# EAGLE design brushless_module_v2 (EAGLE 6.6.0)

## Sheet 1 of 17
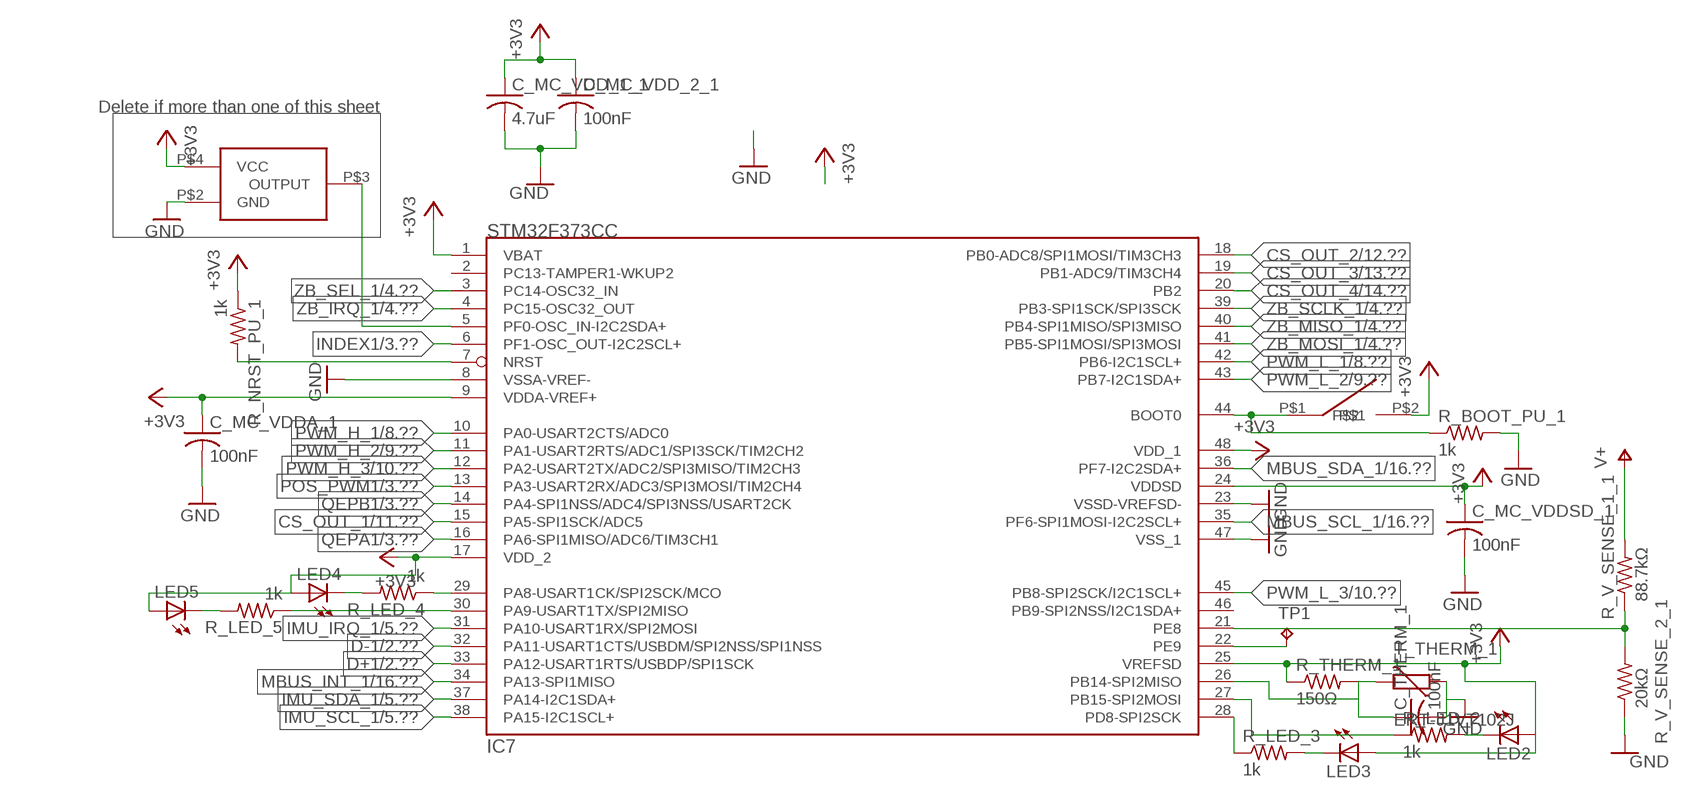
[diagram p0: schematic, sheet 1]

### Parts
C_MC_VDD_1_1  4.7uF  C-USC0603  [C0603]
C_MC_VDD_2_1  100nF  C-USC0603  [C0603]
C_MC_VDDA_1  100nF  C-USC0603  [C0603]
C_MC_VDDSD_1  100nF  C-USC0603  [C0603]
C_THERM_1  100nF  C-USC0603  [C0603]
IC7  STM32F373CC  [LQFP48]
LED2  LEDCHIPLED_0603  [CHIPLED_0603]
LED3  LEDCHIPLED_0603  [CHIPLED_0603]
LED4  LEDCHIPLED_0603  [CHIPLED_0603]
LED5  LEDCHIPLED_0603  [CHIPLED_0603]
OSC1  FOX924B  [4-SMD_5X3.2]
R_BOOT_PU_1  1k  R-US_R0603  [R0603]
R_LED_2  1k  R-US_R0603  [R0603]
R_LED_3  1k  R-US_R0603  [R0603]
R_LED_4  1k  R-US_R0603  [R0603]
R_LED_5  1k  R-US_R0603  [R0603]
R_NRST_PU_1  1k  R-US_R0603  [R0603]
R_THERM_1  150Ω  R-US_R0603  [R0603]
R_V_SENSE_1_1  88.7kΩ  R-US_R0603  [R0603]
R_V_SENSE_2_1  20kΩ  R-US_R0603  [R0603]
SW1  B3U  [B3U]
T_THERM_1  ERT-J1VT102J  VARISTORCN0603  [CT/CN0603]
TP1  TPTP10R  [TP10R]

### Nets
16MHZ_3V3: IC7.5(PF0-OSC_IN-I2C2SDA+) OSC1.P$3(OUTPUT) ; also sheet 4
+3V3: C_MC_VDD_1_1.1 C_MC_VDD_2_1.1 C_MC_VDDA_1.1 C_MC_VDDSD_1.1 IC7.1(VBAT) IC7.9(VDDA-VREF+) IC7.17(VDD_2) IC7.24(VDDSD) IC7.25(VREFSD) IC7.48(VDD_1) LED2.A LED3.A LED4.A LED5.A OSC1.P$4(VCC) R_NRST_PU_1.1 R_THERM_1.1 SW1.P$2 ; also sheet 3,4,5,6,7,14,16
BOOT0_1: IC7.44(BOOT0) R_BOOT_PU_1.1 SW1.P$1
CS_OUT_1: IC7.15(PA5-SPI1SCK/ADC5) ; also sheet 11
CS_OUT_2: IC7.18(PB0-ADC8/SPI1MOSI/TIM3CH3) ; also sheet 12
CS_OUT_3: IC7.19(PB1-ADC9/TIM3CH4) ; also sheet 13
CS_OUT_4: IC7.20(PB2) ; also sheet 14
D+1: IC7.33(PA12-USART1RTS/USBDP/SPI1SCK) ; also sheet 2
D-1: IC7.32(PA11-USART1CTS/USBDM/SPI2NSS/SPI1NSS) ; also sheet 2
GND: C_MC_VDD_1_1.2 C_MC_VDD_2_1.2 C_MC_VDDA_1.2 C_MC_VDDSD_1.2 C_THERM_1.2 IC7.8(VSSA-VREF-) IC7.23(VSSD-VREFSD-) IC7.47(VSS_1) OSC1.P$2(GND) R_BOOT_PU_1.2 R_V_SENSE_2_1.1 T_THERM_1.1 ; also sheet 2,3,4,5,6,7,8,9,10,11,12,13,14,15,16,17
IMU_IRQ_1: IC7.31(PA10-USART1RX/SPI2MOSI) ; also sheet 5
IMU_SCL_1: IC7.38(PA15-I2C1SCL+) ; also sheet 5
IMU_SDA_1: IC7.37(PA14-I2C1SDA+) ; also sheet 5
INDEX1: IC7.6(PF1-OSC_OUT-I2C2SCL+) ; also sheet 3
MBUS_INT_1: IC7.34(PA13-SPI1MISO) ; also sheet 16
MBUS_SCL_1: IC7.35(PF6-SPI1MOSI-I2C2SCL+) ; also sheet 16
MBUS_SDA_1: IC7.36(PF7-I2C2SDA+) ; also sheet 16
N$3: IC7.21(PE8) R_V_SENSE_1_1.1 R_V_SENSE_2_1.2
N$5: LED2.C R_LED_2.2
N$6: LED3.C R_LED_3.2
N$8: IC7.27(PB15-SPI2MOSI) R_LED_2.1
N$9: IC7.28(PD8-SPI2SCK) R_LED_3.1
N$10: LED4.C R_LED_4.2
N$11: LED5.C R_LED_5.2
N$12: IC7.29(PA8-USART1CK/SPI2SCK/MCO) R_LED_4.1
N$13: IC7.30(PA9-USART1TX/SPI2MISO) R_LED_5.1
N$18: IC7.22(PE9) TP1.TP
NRST_1: IC7.7(NRST) R_NRST_PU_1.2
POS_PWM1: IC7.13(PA3-USART2RX/ADC3/SPI3MOSI/TIM2CH4) ; also sheet 3
PWM_H_1: IC7.10(PA0-USART2CTS/ADC0) ; also sheet 8
PWM_H_2: IC7.11(PA1-USART2RTS/ADC1/SPI3SCK/TIM2CH2) ; also sheet 9
PWM_H_3: IC7.12(PA2-USART2TX/ADC2/SPI3MISO/TIM2CH3) ; also sheet 10
PWM_L_1: IC7.42(PB6-I2C1SCL+) ; also sheet 8
PWM_L_2: IC7.43(PB7-I2C1SDA+) ; also sheet 9
PWM_L_3: IC7.45(PB8-SPI2SCK/I2C1SCL+) ; also sheet 10
QEPA1: IC7.16(PA6-SPI1MISO/ADC6/TIM3CH1) ; also sheet 3
QEPB1: IC7.14(PA4-SPI1NSS/ADC4/SPI3NSS/USART2CK) ; also sheet 3
THERM: C_THERM_1.1 IC7.26(PB14-SPI2MISO) R_THERM_1.2 T_THERM_1.2
V+: R_V_SENSE_1_1.2 ; also sheet 6,7,8,9,10,11,12,13,14,15
ZB_IRQ_1: IC7.4(PC15-OSC32_OUT) ; also sheet 4
ZB_MISO_1: IC7.40(PB4-SPI1MISO/SPI3MISO) ; also sheet 4
ZB_MOSI_1: IC7.41(PB5-SPI1MOSI/SPI3MOSI) ; also sheet 4
ZB_SCLK_1: IC7.39(PB3-SPI1SCK/SPI3SCK) ; also sheet 4
ZB_SEL_1: IC7.3(PC14-OSC32_IN) ; also sheet 4
Unconnected: IC7.2(PC13-TAMPER1-WKUP2) IC7.46(PB9-SPI2NSS/I2C1SDA+)

### Notes on the sheet
- Delete if more than one of this sheet

## Sheet 2 of 17
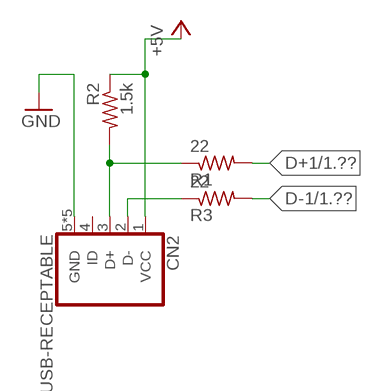
[diagram p1: schematic, sheet 2]

### Parts
CN2  USB-RECEPTABLE  [FCI-10103594-0001LF]
R1  22  R-US_R0603  [R0603]
R2  1.5k  R-US_R0603  [R0603]
R3  22  R-US_R0603  [R0603]

### Nets
+5V: CN2.1(VCC) R2.1 ; also sheet 15
D+1: R1.2 ; also sheet 1
D+_IN_1: CN2.3(D+) R1.1 R2.2
D-1: R3.2 ; also sheet 1
D-_IN_1: CN2.2(D-) R3.1
GND: CN2.5(GND) CN2.P$1(GND) CN2.P$2(GND) CN2.P$3(GND) CN2.P$4(GND) ; also sheet 1,3,4,5,6,7,8,9,10,11,12,13,14,15,16,17
Unconnected: CN2.4(ID)

## Sheet 3 of 17
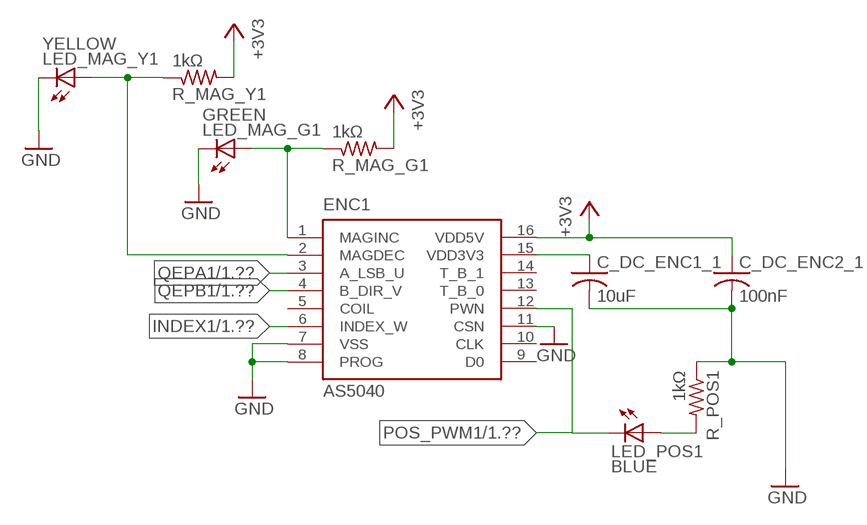
[diagram p2: schematic, sheet 3]

### Parts
C_DC_ENC1_1  10uF  C-USC0603  [C0603]
C_DC_ENC2_1  100nF  C-USC0603  [C0603]
ENC1  AS5040  [SSOP16]
LED_MAG_G1  GREEN  LEDCHIP-LED0603  [CHIP-LED0603]
LED_MAG_Y1  YELLOW  LEDCHIP-LED0603  [CHIP-LED0603]
LED_POS1  BLUE  LEDCHIP-LED0603  [CHIP-LED0603]
R_MAG_G1  1kΩ  R-US_R0603  [R0603]
R_MAG_Y1  1kΩ  R-US_R0603  [R0603]
R_POS1  1kΩ  R-US_R0603  [R0603]

### Nets
+3V3: C_DC_ENC2_1.1 ENC1.16(VDD5V) R_MAG_G1.2 R_MAG_Y1.2 ; also sheet 1,4,5,6,7,14,16
ENC_3V3_1: C_DC_ENC1_1.1 ENC1.15(VDD3V3)
GND: C_DC_ENC1_1.2 C_DC_ENC2_1.2 ENC1.7(VSS) ENC1.8(PROG) ENC1.11(CSN) LED_MAG_G1.C LED_MAG_Y1.C R_POS1.1 ; also sheet 1,2,4,5,6,7,8,9,10,11,12,13,14,15,16,17
INDEX1: ENC1.6(INDEX_W) ; also sheet 1
MAGDEC1: ENC1.2(MAGDEC) LED_MAG_Y1.A R_MAG_Y1.1
MAGINC1: ENC1.1(MAGINC) LED_MAG_G1.A R_MAG_G1.1
N$15: LED_POS1.A R_POS1.2
POS_PWM1: ENC1.12(PWN) LED_POS1.C ; also sheet 1
QEPA1: ENC1.3(A_LSB_U) ; also sheet 1
QEPB1: ENC1.4(B_DIR_V) ; also sheet 1
Unconnected: ENC1.5(COIL) ENC1.9(D0) ENC1.10(CLK) ENC1.13(T_B_0) ENC1.14(T_B_1)

## Sheet 4 of 17
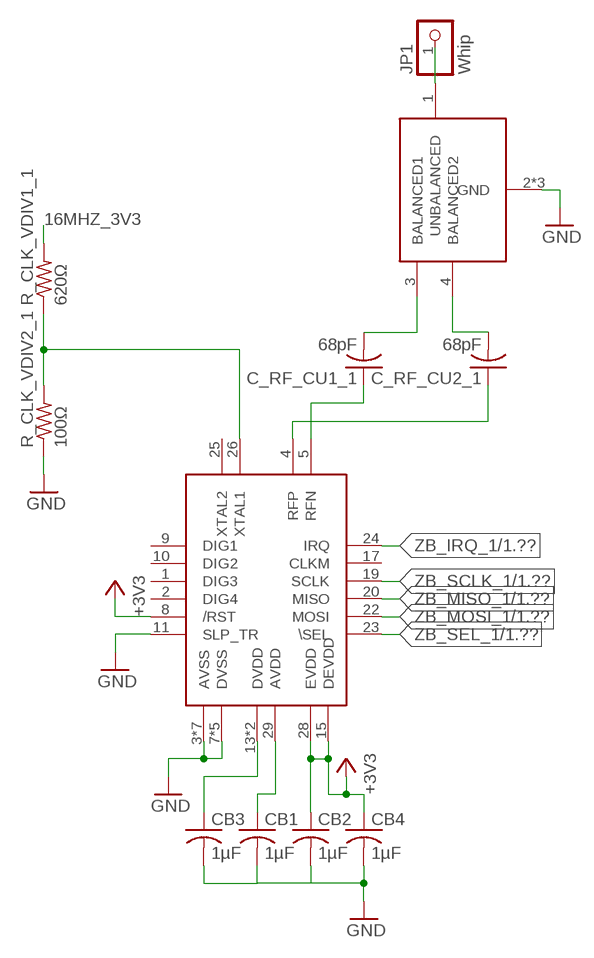
[diagram p3: schematic, sheet 4]

### Parts
BALUN1  0896FB15A0100  [0896FB15A0100]
C_RF_CU1_1  68pF  C-USC0603  [C0603]
C_RF_CU2_1  68pF  C-USC0603  [C0603]
CB1  1µF  C-USC0603  [C0603]
CB2  1µF  C-USC0603  [C0603]
CB3  1µF  C-USC0603  [C0603]
CB4  1µF  C-USC0603  [C0603]
JP1  Whip  PINHD-1X01_2.00  [1X01M]
R_CLK_VDIV1_1  620Ω  R-US_R0603  [R0603]
R_CLK_VDIV2_1  100Ω  R-US_R0603  [R0603]
RADIO1  AT86RF  [QFNN32]

### Nets
16MHZ_0V5_1: R_CLK_VDIV1_1.1 R_CLK_VDIV2_1.2 RADIO1.26(XTAL1)
16MHZ_3V3: R_CLK_VDIV1_1.2 ; also sheet 1
+3V3: CB2.1 CB4.1 RADIO1.8(/RST) RADIO1.15(DEVDD) RADIO1.28(EVDD) ; also sheet 1,3,5,6,7,14,16
ANT1: BALUN1.1(UNBALANCED) JP1.1
GND: BALUN1.2(GND) BALUN1.5(GND) BALUN1.6(GND) CB1.2 CB2.2 CB3.2 CB4.2 R_CLK_VDIV2_1.1 RADIO1.3(AVSS) RADIO1.6(AVSS) RADIO1.7(DVSS) RADIO1.11(SLP_TR) RADIO1.12(DVSS) RADIO1.16(DVSS) RADIO1.18(DVSS) RADIO1.21(DVSS) RADIO1.27(AVSS) RADIO1.30(AVSS) RADIO1.31(AVSS) RADIO1.32(AVSS) RADIO1.EXP(AVSS) ; also sheet 1,2,3,5,6,7,8,9,10,11,12,13,14,15,16,17
ZB_AVDD1: CB1.1 RADIO1.29(AVDD)
ZB_BAL1_1: BALUN1.3(BALANCED1) C_RF_CU1_1.2
ZB_BAL2_1: BALUN1.4(BALANCED2) C_RF_CU2_1.2
ZB_DVDD1: CB3.1 RADIO1.13(DVDD) RADIO1.14(DVDD)
ZB_IRQ_1: RADIO1.24(IRQ) ; also sheet 1
ZB_MISO_1: RADIO1.20(MISO) ; also sheet 1
ZB_MOSI_1: RADIO1.22(MOSI) ; also sheet 1
ZB_RFN1: C_RF_CU2_1.1 RADIO1.4(RFP)
ZB_RFP1: C_RF_CU1_1.1 RADIO1.5(RFN)
ZB_SCLK_1: RADIO1.19(SCLK) ; also sheet 1
ZB_SEL_1: RADIO1.23(\SEL) ; also sheet 1
Unconnected: RADIO1.1(DIG3) RADIO1.2(DIG4) RADIO1.9(DIG1) RADIO1.10(DIG2) RADIO1.17(CLKM) RADIO1.25(XTAL2)

## Sheet 5 of 17
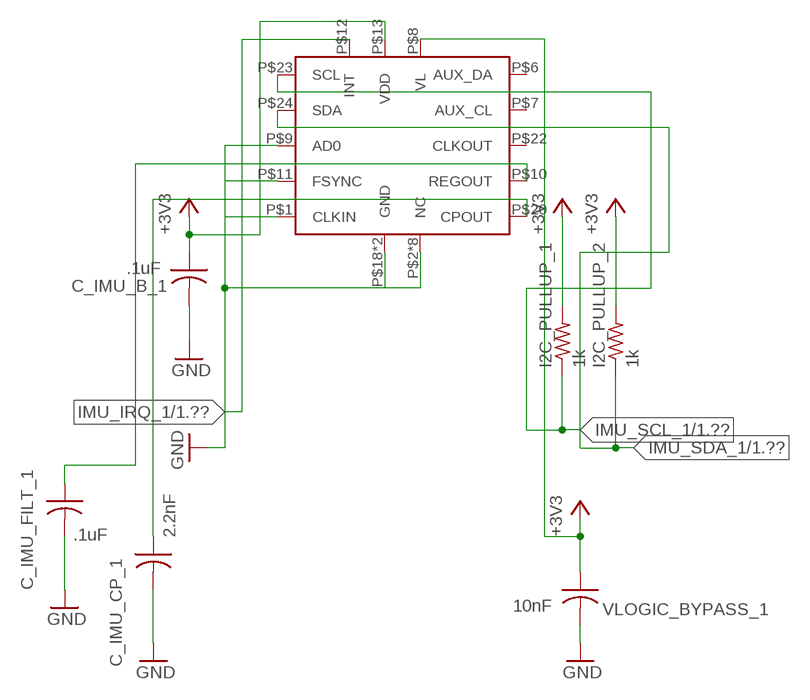
[diagram p4: schematic, sheet 5]

### Parts
C_IMU_B_1  .1uF  C-USC0603  [C0603]
C_IMU_CP_1  2.2nF  C-USC0603  [C0603]
C_IMU_FILT_1  .1uF  C-USC0603  [C0603]
I2C_PULLUP_1  1k  R-US_R0603  [R0603]
I2C_PULLUP_2  1k  R-US_R0603  [R0603]
U$10  MPU-6050  [QFN24]
VLOGIC_BYPASS_1  10nF  C-USC0603  [C0603]

### Nets
+3V3: C_IMU_B_1.1 I2C_PULLUP_1.2 I2C_PULLUP_2.2 U$10.P$8(VL) U$10.P$13(VDD) VLOGIC_BYPASS_1.1 ; also sheet 1,3,4,6,7,14,16
CPOUT_1: C_IMU_CP_1.1 U$10.P$20(CPOUT)
GND: C_IMU_B_1.2 C_IMU_CP_1.2 C_IMU_FILT_1.2 U$10.P$1(CLKIN) U$10.P$2(NC) U$10.P$3(NC) U$10.P$4(NC) U$10.P$5(NC) U$10.P$9(AD0) U$10.P$11(FSYNC) U$10.P$14(NC) U$10.P$15(NC) U$10.P$16(NC) U$10.P$17(NC) U$10.P$18(GND) U$10.P$25(GND) VLOGIC_BYPASS_1.2 ; also sheet 1,2,3,4,6,7,8,9,10,11,12,13,14,15,16,17
IMU_IRQ_1: U$10.P$12(INT) ; also sheet 1
IMU_SCL_1: I2C_PULLUP_1.1 U$10.P$23(SCL) ; also sheet 1
IMU_SDA_1: I2C_PULLUP_2.1 U$10.P$24(SDA) ; also sheet 1
REGOUT_1: C_IMU_FILT_1.1 U$10.P$10(REGOUT)
Unconnected: U$10.P$6(AUX_DA) U$10.P$7(AUX_CL) U$10.P$22(CLKOUT)

## Sheet 6 of 17
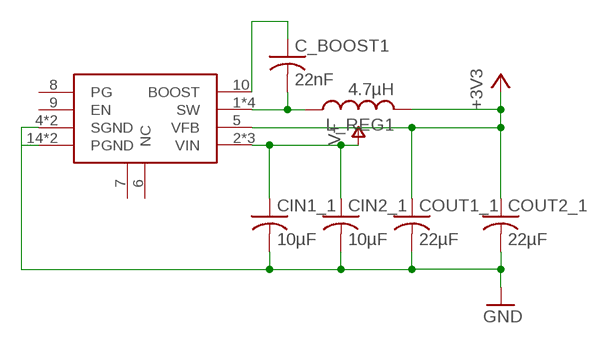
[diagram p5: schematic, sheet 6]

### Parts
C_BOOST1  22nF  C-USC0603  [C0603]
CIN1_1  10µF  C-USC0805  [C0805]
CIN2_1  10µF  C-USC0805  [C0805]
COUT1_1  22µF  C-USC0603  [C0603]
COUT2_1  22µF  C-USC0603  [C0603]
L_REG1  4.7µH  VLC5045  [VLC5045]
SW_REG1  MCP16323  [QFN16]

### Nets
+3V3: COUT1_1.1 COUT2_1.1 L_REG1.2 SW_REG1.5(VFB) ; also sheet 1,3,4,5,7,14,16
BOOST1: C_BOOST1.1 SW_REG1.10(BOOST)
GND: CIN1_1.2 CIN2_1.2 COUT1_1.2 COUT2_1.2 SW_REG1.4(SGND) SW_REG1.14(PGND) SW_REG1.15(PGND) SW_REG1.TH(SGND) ; also sheet 1,2,3,4,5,7,8,9,10,11,12,13,14,15,16,17
SW1: C_BOOST1.2 L_REG1.1 SW_REG1.1(SW) SW_REG1.12(SW) SW_REG1.13(SW) SW_REG1.16(SW)
V+: CIN1_1.1 CIN2_1.1 SW_REG1.2(VIN) SW_REG1.3(VIN) SW_REG1.11(VIN) ; also sheet 1,7,8,9,10,11,12,13,14,15
Unconnected: SW_REG1.6(NC) SW_REG1.7(NC2) SW_REG1.8(PG) SW_REG1.9(EN)

## Sheet 7 of 17
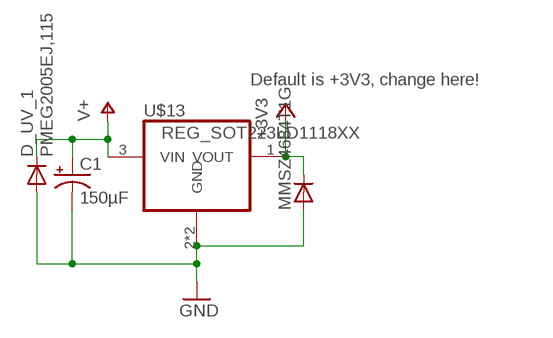
[diagram p6: schematic, sheet 7]

### Parts
C1  150µF  CPOL-USD/7343-31R  [D/7343-31R]
D_UV_1  PMEG2005EJ,115  DIODE-SOD323-W  [SOD323-W]
MMSZ4684T1G  D-SOD123  [SOD123]
U$13  REG_SOT223LD1118XX  [SOT-223]

### Nets
+3V3: MMSZ4684T1G.1(C) U$13.1(VOUT) ; also sheet 1,3,4,5,6,14,16
GND: C1.- D_UV_1.A MMSZ4684T1G.2(A) U$13.2(GND) U$13.4(GND) ; also sheet 1,2,3,4,5,6,8,9,10,11,12,13,14,15,16,17
V+: C1.+ D_UV_1.C U$13.3(VIN) ; also sheet 1,6,8,9,10,11,12,13,14,15

### Notes on the sheet
- Default is +3V3, change here!

## Sheet 8 of 17
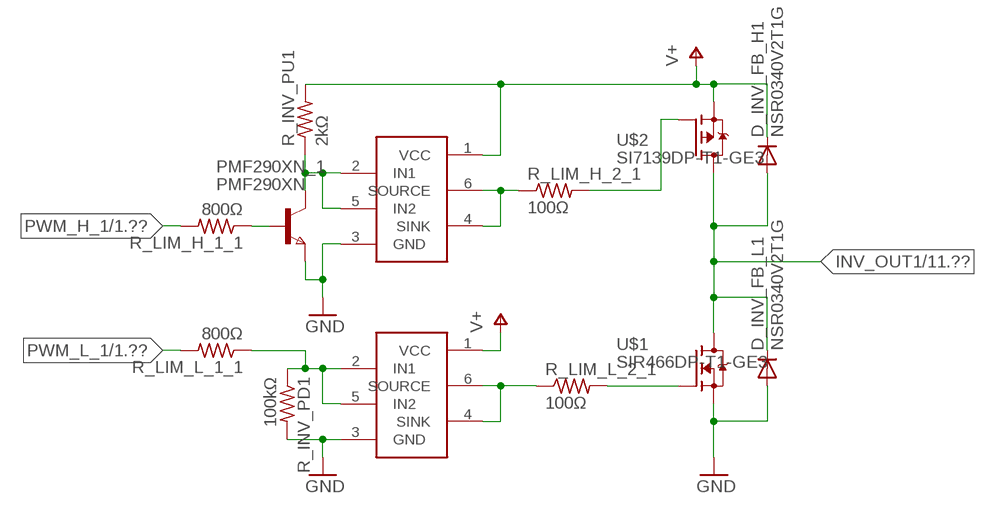
[diagram p7: schematic, sheet 8]

### Parts
D_INV_FB_H1  NSR0340V2T1G  DIODE-SOD523  [SOD523]
D_INV_FB_L1  NSR0340V2T1G  DIODE-SOD523  [SOD523]
PMF290XN_1  PMF290XN  NPNSOT323  [SOT323]
R_INV_PD1  100kΩ  R-US_R0603  [R0603]
R_INV_PU1  2kΩ  R-US_R0603  [R0603]
R_LIM_H_1_1  800Ω  R-US_R0603  [R0603]
R_LIM_H_2_1  100Ω  R-US_R0603  [R0603]
R_LIM_L_1_1  800Ω  R-US_R0603  [R0603]
R_LIM_L_2_1  100Ω  R-US_R0603  [R0603]
U$1  SIR466DP-T1-GE3  [S0-8-POWERPAK]
U$2  SI7139DP-T1-GE3  [S0-8-POWERPAK]
ZXGD3004E6_H_1  ZXGD3004E6  [SOT23-6]
ZXGD3004E6_L_1  ZXGD3004E6  [SOT23-6]

### Nets
GATE_DRV_HIGH_IN1: PMF290XN_1.1(C) R_INV_PU1.1 ZXGD3004E6_H_1.2(IN1) ZXGD3004E6_H_1.5(IN2)
GATE_DRV_LOW_IN1: R_INV_PD1.1 R_LIM_L_1_1.1 ZXGD3004E6_L_1.2(IN1) ZXGD3004E6_L_1.5(IN2)
GND: D_INV_FB_L1.A PMF290XN_1.3(E) R_INV_PD1.2 U$1.1(S) U$1.2(S) U$1.3(S) ZXGD3004E6_H_1.3(GND) ZXGD3004E6_L_1.3(GND) ; also sheet 1,2,3,4,5,6,7,9,10,11,12,13,14,15,16,17
INV_HIGH_GATE1: R_LIM_H_2_1.2 U$2.4(G)
INV_HIGH_GSS1: R_LIM_H_2_1.1 ZXGD3004E6_H_1.4(SINK) ZXGD3004E6_H_1.6(SOURCE)
INV_LOW_GATE1: R_LIM_L_2_1.2 U$1.4(G)
INV_LOW_GSS1: R_LIM_L_2_1.1 ZXGD3004E6_L_1.4(SINK) ZXGD3004E6_L_1.6(SOURCE)
INV_OUT1: D_INV_FB_H1.A D_INV_FB_L1.C U$1.5(D) U$1.6(D) U$1.7(D) U$1.8(D) U$1.P$1(D) U$2.5(D) U$2.6(D) U$2.7(D) U$2.8(D) U$2.P$1(D) ; also sheet 11
N$30: PMF290XN_1.2(B) R_LIM_H_1_1.1
PWM_H_1: R_LIM_H_1_1.2 ; also sheet 1
PWM_L_1: R_LIM_L_1_1.2 ; also sheet 1
V+: D_INV_FB_H1.C R_INV_PU1.2 U$2.1(S) U$2.2(S) U$2.3(S) ZXGD3004E6_H_1.1(VCC) ZXGD3004E6_L_1.1(VCC) ; also sheet 1,6,7,9,10,11,12,13,14,15

## Sheet 9 of 17
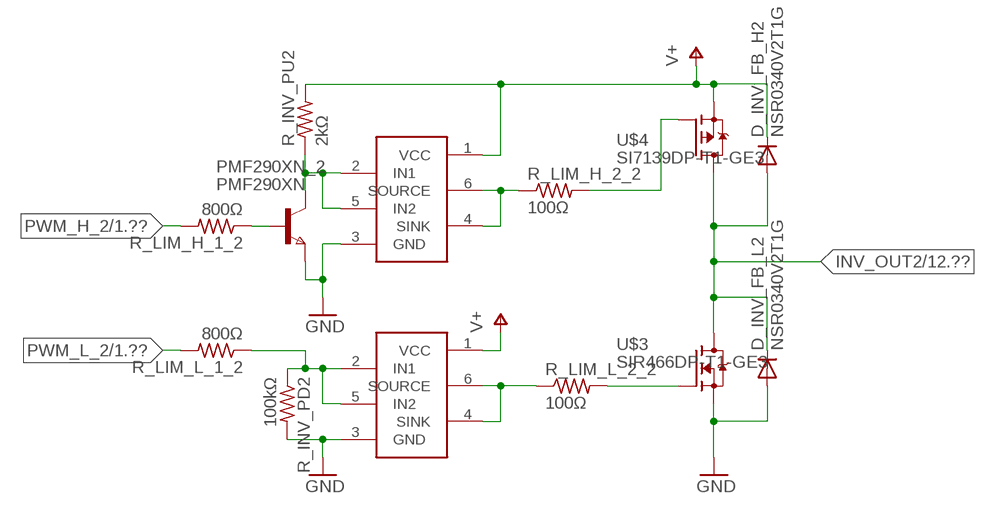
[diagram p8: schematic, sheet 9]

### Parts
D_INV_FB_H2  NSR0340V2T1G  DIODE-SOD523  [SOD523]
D_INV_FB_L2  NSR0340V2T1G  DIODE-SOD523  [SOD523]
PMF290XN_2  PMF290XN  NPNSOT323  [SOT323]
R_INV_PD2  100kΩ  R-US_R0603  [R0603]
R_INV_PU2  2kΩ  R-US_R0603  [R0603]
R_LIM_H_1_2  800Ω  R-US_R0603  [R0603]
R_LIM_H_2_2  100Ω  R-US_R0603  [R0603]
R_LIM_L_1_2  800Ω  R-US_R0603  [R0603]
R_LIM_L_2_2  100Ω  R-US_R0603  [R0603]
U$3  SIR466DP-T1-GE3  [S0-8-POWERPAK]
U$4  SI7139DP-T1-GE3  [S0-8-POWERPAK]
ZXGD3004E6_H_2  ZXGD3004E6  [SOT23-6]
ZXGD3004E6_L_2  ZXGD3004E6  [SOT23-6]

### Nets
GATE_DRV_HIGH_IN2: PMF290XN_2.1(C) R_INV_PU2.1 ZXGD3004E6_H_2.2(IN1) ZXGD3004E6_H_2.5(IN2)
GATE_DRV_LOW_IN2: R_INV_PD2.1 R_LIM_L_1_2.1 ZXGD3004E6_L_2.2(IN1) ZXGD3004E6_L_2.5(IN2)
GND: D_INV_FB_L2.A PMF290XN_2.3(E) R_INV_PD2.2 U$3.1(S) U$3.2(S) U$3.3(S) ZXGD3004E6_H_2.3(GND) ZXGD3004E6_L_2.3(GND) ; also sheet 1,2,3,4,5,6,7,8,10,11,12,13,14,15,16,17
INV_HIGH_GATE2: R_LIM_H_2_2.2 U$4.4(G)
INV_HIGH_GSS2: R_LIM_H_2_2.1 ZXGD3004E6_H_2.4(SINK) ZXGD3004E6_H_2.6(SOURCE)
INV_LOW_GATE2: R_LIM_L_2_2.2 U$3.4(G)
INV_LOW_GSS2: R_LIM_L_2_2.1 ZXGD3004E6_L_2.4(SINK) ZXGD3004E6_L_2.6(SOURCE)
INV_OUT2: D_INV_FB_H2.A D_INV_FB_L2.C U$3.5(D) U$3.6(D) U$3.7(D) U$3.8(D) U$3.P$1(D) U$4.5(D) U$4.6(D) U$4.7(D) U$4.8(D) U$4.P$1(D) ; also sheet 12
N$1: PMF290XN_2.2(B) R_LIM_H_1_2.1
PWM_H_2: R_LIM_H_1_2.2 ; also sheet 1
PWM_L_2: R_LIM_L_1_2.2 ; also sheet 1
V+: D_INV_FB_H2.C R_INV_PU2.2 U$4.1(S) U$4.2(S) U$4.3(S) ZXGD3004E6_H_2.1(VCC) ZXGD3004E6_L_2.1(VCC) ; also sheet 1,6,7,8,10,11,12,13,14,15

## Sheet 10 of 17
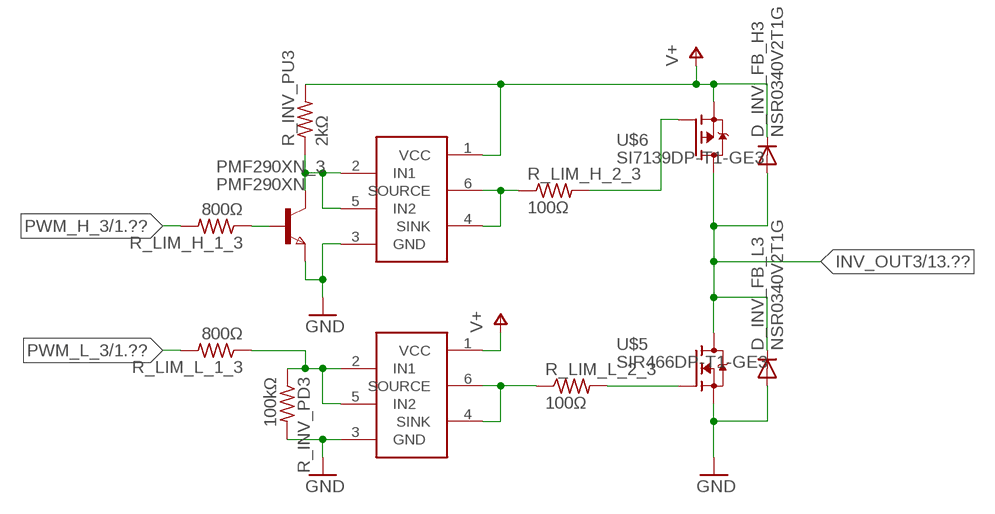
[diagram p9: schematic, sheet 10]

### Parts
D_INV_FB_H3  NSR0340V2T1G  DIODE-SOD523  [SOD523]
D_INV_FB_L3  NSR0340V2T1G  DIODE-SOD523  [SOD523]
PMF290XN_3  PMF290XN  NPNSOT323  [SOT323]
R_INV_PD3  100kΩ  R-US_R0603  [R0603]
R_INV_PU3  2kΩ  R-US_R0603  [R0603]
R_LIM_H_1_3  800Ω  R-US_R0603  [R0603]
R_LIM_H_2_3  100Ω  R-US_R0603  [R0603]
R_LIM_L_1_3  800Ω  R-US_R0603  [R0603]
R_LIM_L_2_3  100Ω  R-US_R0603  [R0603]
U$5  SIR466DP-T1-GE3  [S0-8-POWERPAK]
U$6  SI7139DP-T1-GE3  [S0-8-POWERPAK]
ZXGD3004E6_H_3  ZXGD3004E6  [SOT23-6]
ZXGD3004E6_L_3  ZXGD3004E6  [SOT23-6]

### Nets
GATE_DRV_HIGH_IN3: PMF290XN_3.1(C) R_INV_PU3.1 ZXGD3004E6_H_3.2(IN1) ZXGD3004E6_H_3.5(IN2)
GATE_DRV_LOW_IN3: R_INV_PD3.1 R_LIM_L_1_3.1 ZXGD3004E6_L_3.2(IN1) ZXGD3004E6_L_3.5(IN2)
GND: D_INV_FB_L3.A PMF290XN_3.3(E) R_INV_PD3.2 U$5.1(S) U$5.2(S) U$5.3(S) ZXGD3004E6_H_3.3(GND) ZXGD3004E6_L_3.3(GND) ; also sheet 1,2,3,4,5,6,7,8,9,11,12,13,14,15,16,17
INV_HIGH_GATE3: R_LIM_H_2_3.2 U$6.4(G)
INV_HIGH_GSS3: R_LIM_H_2_3.1 ZXGD3004E6_H_3.4(SINK) ZXGD3004E6_H_3.6(SOURCE)
INV_LOW_GATE3: R_LIM_L_2_3.2 U$5.4(G)
INV_LOW_GSS3: R_LIM_L_2_3.1 ZXGD3004E6_L_3.4(SINK) ZXGD3004E6_L_3.6(SOURCE)
INV_OUT3: D_INV_FB_H3.A D_INV_FB_L3.C U$5.5(D) U$5.6(D) U$5.7(D) U$5.8(D) U$5.P$1(D) U$6.5(D) U$6.6(D) U$6.7(D) U$6.8(D) U$6.P$1(D) ; also sheet 13
N$2: PMF290XN_3.2(B) R_LIM_H_1_3.1
PWM_H_3: R_LIM_H_1_3.2 ; also sheet 1
PWM_L_3: R_LIM_L_1_3.2 ; also sheet 1
V+: D_INV_FB_H3.C R_INV_PU3.2 U$6.1(S) U$6.2(S) U$6.3(S) ZXGD3004E6_H_3.1(VCC) ZXGD3004E6_L_3.1(VCC) ; also sheet 1,6,7,8,9,11,12,13,14,15

## Sheet 11 of 17
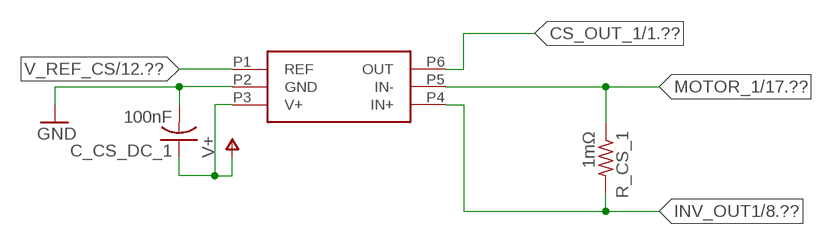
[diagram p10: schematic, sheet 11]

### Parts
C_CS_DC_1  100nF  C-USC0603  [C0603]
CS_1  INA21X  [SC70]
R_CS_1  1mΩ  R-US_R1206  [R1206]

### Nets
CS_OUT_1: CS_1.P6(OUT) ; also sheet 1
GND: C_CS_DC_1.2 CS_1.P2(GND) ; also sheet 1,2,3,4,5,6,7,8,9,10,12,13,14,15,16,17
INV_OUT1: CS_1.P4(IN+) R_CS_1.2 ; also sheet 8
MOTOR_1: CS_1.P5(IN-) R_CS_1.1 ; also sheet 17
V+: C_CS_DC_1.1 CS_1.P3(V+) ; also sheet 1,6,7,8,9,10,12,13,14,15
V_REF_CS: CS_1.P1(REF) ; also sheet 12,13,14

## Sheet 12 of 17
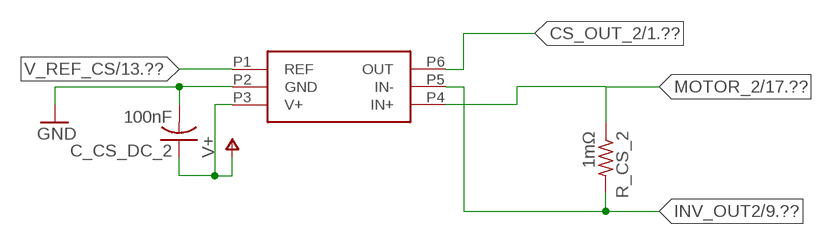
[diagram p11: schematic, sheet 12]

### Parts
C_CS_DC_2  100nF  C-USC0603  [C0603]
CS_2  INA21X  [SC70]
R_CS_2  1mΩ  R-US_R1206  [R1206]

### Nets
CS_OUT_2: CS_2.P6(OUT) ; also sheet 1
GND: C_CS_DC_2.2 CS_2.P2(GND) ; also sheet 1,2,3,4,5,6,7,8,9,10,11,13,14,15,16,17
INV_OUT2: CS_2.P5(IN-) R_CS_2.2 ; also sheet 9
MOTOR_2: CS_2.P4(IN+) R_CS_2.1 ; also sheet 17
V+: C_CS_DC_2.1 CS_2.P3(V+) ; also sheet 1,6,7,8,9,10,11,13,14,15
V_REF_CS: CS_2.P1(REF) ; also sheet 11,13,14

## Sheet 13 of 17
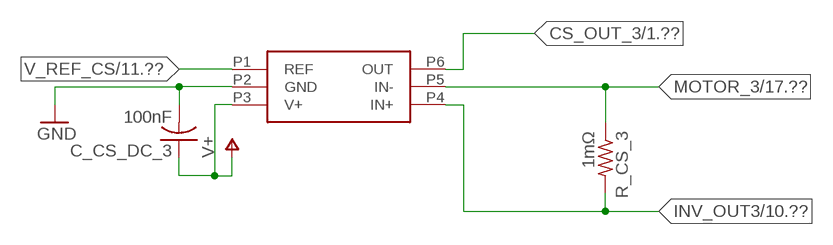
[diagram p12: schematic, sheet 13]

### Parts
C_CS_DC_3  100nF  C-USC0603  [C0603]
CS_3  INA21X  [SC70]
R_CS_3  1mΩ  R-US_R1206  [R1206]

### Nets
CS_OUT_3: CS_3.P6(OUT) ; also sheet 1
GND: C_CS_DC_3.2 CS_3.P2(GND) ; also sheet 1,2,3,4,5,6,7,8,9,10,11,12,14,15,16,17
INV_OUT3: CS_3.P4(IN+) R_CS_3.2 ; also sheet 10
MOTOR_3: CS_3.P5(IN-) R_CS_3.1 ; also sheet 17
V+: C_CS_DC_3.1 CS_3.P3(V+) ; also sheet 1,6,7,8,9,10,11,12,14,15
V_REF_CS: CS_3.P1(REF) ; also sheet 11,12,14

## Sheet 14 of 17
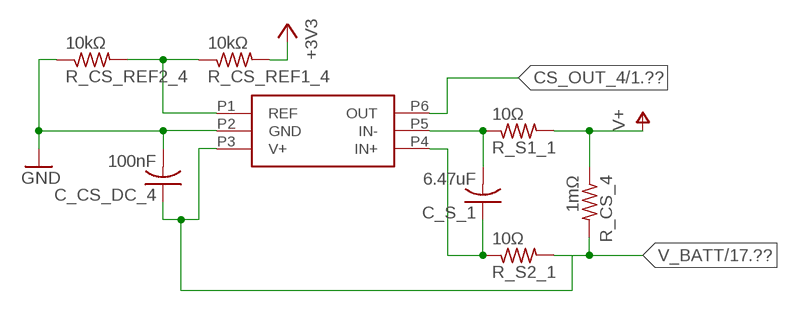
[diagram p13: schematic, sheet 14]

### Parts
C_CS_DC_4  100nF  C-USC0603  [C0603]
C_S_1  6.47uF  C-USC0603  [C0603]
CS_4  INA21X  [SC70]
R_CS_4  1mΩ  R-US_R1206  [R1206]
R_CS_REF1_4  10kΩ  R-US_R0603  [R0603]
R_CS_REF2_4  10kΩ  R-US_R0603  [R0603]
R_S1_1  10Ω  R-US_R0603  [R0603]
R_S2_1  10Ω  R-US_R0603  [R0603]

### Nets
+3V3: R_CS_REF1_4.2 ; also sheet 1,3,4,5,6,7,16
CS_OUT_4: CS_4.P6(OUT) ; also sheet 1
GND: C_CS_DC_4.2 CS_4.P2(GND) R_CS_REF2_4.1 ; also sheet 1,2,3,4,5,6,7,8,9,10,11,12,13,15,16,17
IN+_1: C_S_1.1 CS_4.P4(IN+) R_S2_1.1
IN-_1: C_S_1.2 CS_4.P5(IN-) R_S1_1.1
V+: R_CS_4.1 R_S1_1.2 ; also sheet 1,6,7,8,9,10,11,12,13,15
V_BATT: C_CS_DC_4.1 CS_4.P3(V+) R_CS_4.2 R_S2_1.2 ; also sheet 17
V_REF_CS: CS_4.P1(REF) R_CS_REF1_4.1 R_CS_REF2_4.2 ; also sheet 11,12,13

## Sheet 15 of 17
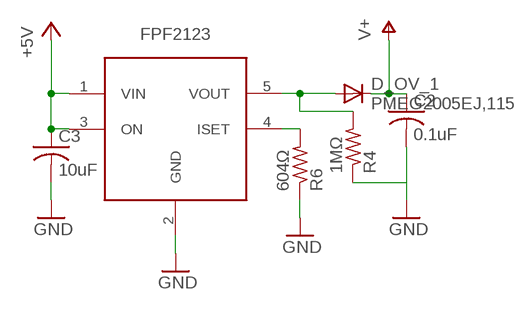
[diagram p14: schematic, sheet 15]

### Parts
C2  0.1uF  C-USC0603  [C0603]
C3  10uF  C-USC0603  [C0603]
D_OV_1  PMEG2005EJ,115  DIODE-SOD323-W  [SOD323-W]
FPF2123  FPF2123  [SOT23-5L]
R4  1MΩ  R-US_R0603  [R0603]
R6  604Ω  R-US_R0603  [R0603]

### Nets
+5V: C3.1 FPF2123.1(VIN) FPF2123.3(ON) ; also sheet 2
GND: C2.2 C3.2 FPF2123.2(GND) R4.1 R6.1 ; also sheet 1,2,3,4,5,6,7,8,9,10,11,12,13,14,16,17
LOAD_ISET_1: FPF2123.4(ISET) R6.2
N$17: D_OV_1.A FPF2123.5(VOUT) R4.2
V+: C2.1 D_OV_1.C ; also sheet 1,6,7,8,9,10,11,12,13,14

## Sheet 16 of 17
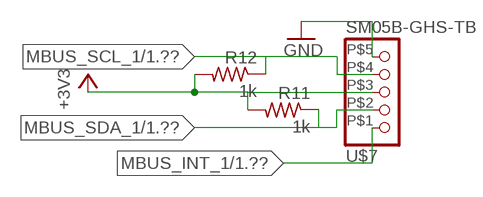
[diagram p15: schematic, sheet 16]

### Parts
R11  1k  R-US_R0603  [R0603]
R12  1k  R-US_R0603  [R0603]
U$7  SM05B-GHS-TB  [SM05B-GHS-TB]

### Nets
+3V3: R11.2 R12.2 U$7.P$3 ; also sheet 1,3,4,5,6,7,14
GND: U$7.P$5 ; also sheet 1,2,3,4,5,6,7,8,9,10,11,12,13,14,15,17
MBUS_INT_1: U$7.P$1 ; also sheet 1
MBUS_SCL_1: R12.1 U$7.P$4 ; also sheet 1
MBUS_SDA_1: R11.1 U$7.P$2 ; also sheet 1

## Sheet 17 of 17
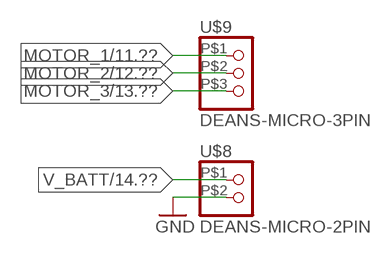
[diagram p16: schematic, sheet 17]

### Parts
U$8  DEANS-MICRO-2PIN  [DEANS-MICRO-2PIN]
U$9  DEANS-MICRO-3PIN  [DEANS-MICRO-3PIN]

### Nets
GND: U$8.P$2 ; also sheet 1,2,3,4,5,6,7,8,9,10,11,12,13,14,15,16
MOTOR_1: U$9.P$1 ; also sheet 11
MOTOR_2: U$9.P$2 ; also sheet 12
MOTOR_3: U$9.P$3 ; also sheet 13
V_BATT: U$8.P$1 ; also sheet 14

## Library data of the parts
BALUN1 = piccoli:0896FB15A0100
C1 = rcl:CPOL-US: POLARIZED CAPACITOR, American symbol
C2 C3 C_BOOST1 C_CS_DC_1-C_CS_DC_4 C_DC_ENC1_1 C_DC_ENC2_1 C_IMU_B_1 C_IMU_CP_1 C_IMU_FILT_1 C_MC_VDD_1_1 C_MC_VDD_2_1 C_MC_VDDA_1 C_MC_VDDSD_1 C_RF_CU1_1 C_RF_CU2_1 C_S_1 C_THERM_1 CB1-CB4 CIN1_1 CIN2_1 COUT1_1 COUT2_1 VLOGIC_BYPASS_1 = resistor:C-US: CAPACITOR, American symbol
CN2 = neels:USB-RECEPTABLE: USB Receptable
CS_1-CS_4 = piccoli:INA21X
D_INV_FB_H1-D_INV_FB_H3 D_INV_FB_L1-D_INV_FB_L3 D_OV_1 D_UV_1 = diode:DIODE-: DIODE
ENC1 = austriamicrosystems:AS5040: 10-BIT PROGRAMMABLE MAGNETIC ROTARY ENCODER Source: www.austriamicrosystems.com .. AS5040DataSheetRev12.pdf; MPN: AS5040ASSU; OC_FARNELL: 1630800; OC_NEWARK: 59P4059
FPF2123 = neels:FPF2123
I2C_PULLUP_1 I2C_PULLUP_2 R1-R4 R6 R11 R12 R_BOOT_PU_1 R_CLK_VDIV1_1 R_CLK_VDIV2_1 R_CS_1-R_CS_4 R_CS_REF1_4 R_CS_REF2_4 R_INV_PU1-R_INV_PU3 R_LED_2-R_LED_5 R_LIM_H_1_1-R_LIM_H_1_3 R_LIM_H_2_1-R_LIM_H_2_3 R_LIM_L_1_1-R_LIM_L_1_3 R_LIM_L_2_1-R_LIM_L_2_3 R_MAG_G1 R_MAG_Y1 R_NRST_PU_1 R_POS1 R_S1_1 R_S2_1 R_THERM_1 R_V_SENSE_1_1 R_V_SENSE_2_1 = resistor:R-US_: RESISTOR, American symbol
IC7 = neels:STM32F373CC
JP1 = pinhead-2:PINHD-1X01: PIN HEADER
L_REG1 = piccoli:VLC5045
LED2-LED5 LED_MAG_G1 LED_MAG_Y1 LED_POS1 = led:LED: LED OSRAM: - CHIPLED LG R971, LG N971, LY N971, LG Q971, LY Q971, LO R971, LY R971 LH N974, LH R974 LS Q976, LO Q976, LY Q976 LO Q996 - Hyper CHIPLED LW Q18S LB Q993, LB Q99A, LB R99A - SideLED LS A670, LO A670, LY A670, LG A670, LP A670 LB A673, LV A673, LT A673, LW A673 LH A674 LY A675 LS A676, LA A676, LO A676, LY A676, LW A676 LS A679, LY A679, LG A679 - Hyper Micro SIDELED® LS Y876, LA Y876, LO Y876, LY Y876 LT Y87S - SmartLED LW L88C, LW L88S LB L89C, LB L89S, LG L890 LS L89K, LO L89K, LY L89K LS L896, LA L896, LO L896, LY L896 - TOPLED LS T670, LO T670, LY T670, LG T670, LP T670 LSG T670, LSP T670, LSY T670, LOP T670, LYG T670 LG T671, LOG T671, LSG T671 LB T673, LV T673, LT T673, LW T673 LH T674 LS T676, LA T676, LO T676, LY T676, LB T676, LH T676, LSB T676, LW T676 LB T67C, LV T67C, LT T67C, LS T67K, LO T67K, LY T67K, LW E67C LS E67B, LA E67B, LO E67B, LY E67B, LB E67C, LV E67C, LT E67C LW T67C LS T679, LY T679, LG T679 LS T770, LO T770, LY T770, LG T770, LP T770 LB T773, LV T773, LT T773, LW T773 LH T774 LS E675, LA E675, LY E675, LS T675 LS T776, LA T776, LO T776, LY T776, LB T776 LHGB T686 LT T68C, LB T68C - Hyper Mini TOPLED® LB M676 - Mini TOPLED Santana® LG M470 LS M47K, LO M47K, LY M47K Source: http://www.osram.convergy.de LUXEON: - LUMILED® LXK2-PW12-R00, LXK2-PW12-S00, LXK2-PW14-U00, LXK2-PW14-V00 LXK2-PM12-R00, LXK2-PM12-S00, LXK2-PM14-U00 LXK2-PE12-Q00, LXK2-PE12-R00, LXK2-PE12-S00, LXK2-PE14-T00, LXK2-PE14-U00 LXK2-PB12-K00, LXK2-PB12-L00, LXK2-PB12-M00, LXK2-PB14-N00, LXK2-PB14-P00, LXK2-PB14-Q00 LXK2-PR12-L00, LXK2-PR12-M00, LXK2-PR14-Q00, LXK2-PR14-R00 LXK2-PD12-Q00, LXK2-PD12-R00, LXK2-PD12-S00 LXK2-PH12-R00, LXK2-PH12-S00 LXK2-PL12-P00, LXK2-PL12-Q00, LXK2-PL12-R00 Source: www.luxeon.com KINGBRIGHT: KA-3528ASYC Source: www.kingbright.com
MMSZ4684T1G = semicon-smd-ipc:D-: DIODE unfilled
OSC1 = piccoli:FOX924B
PMF290XN_1-PMF290XN_3 = zetex:NPNSOT323: NPN TRANSISTOR; MPN: DSS4160U-7; OC_FARNELL: 1710696; OC_NEWARK: 25R4558
R_INV_PD1-R_INV_PD3 = resistor:R-US_: RESISTOR, American symbol; LINK: http://search.digikey.com/scripts/DkSearch/dksus.dll?Detail&itemSeq=101345852&uq=634438181961297244; ORDERED: 100; PART#: RNCP0603FTD825RCT-ND; VENDOR: Digikey
RADIO1 = piccoli:AT86RF
SW1 = zz-upenn:B3U
SW_REG1 = piccoli:MCP16323
T_THERM_1 = varistor:VARISTOR: VARISTOR
TP1 = testpad:TP: Test pad
U$1 U$3 U$5 = piccoli:SIR466DP-T1-GE3
U$2 U$4 U$6 = piccoli:SI7139DP-T1-GE3
U$7 = piccoli:SM05B-GHS-TB
U$8 = piccoli:DEANS-MICRO-2PIN
U$9 = piccoli:DEANS-MICRO-3PIN
U$10 = zz-upenn 2:MPU-6050
U$13 = piccoli:REG_SOT223
ZXGD3004E6_H_1-ZXGD3004E6_H_3 ZXGD3004E6_L_1-ZXGD3004E6_L_3 = piccoli:ZXGD3004E6

## Net classes
0 default: width 0.178 mm, drill 0.381 mm, clearance 0.178 mm

## Board
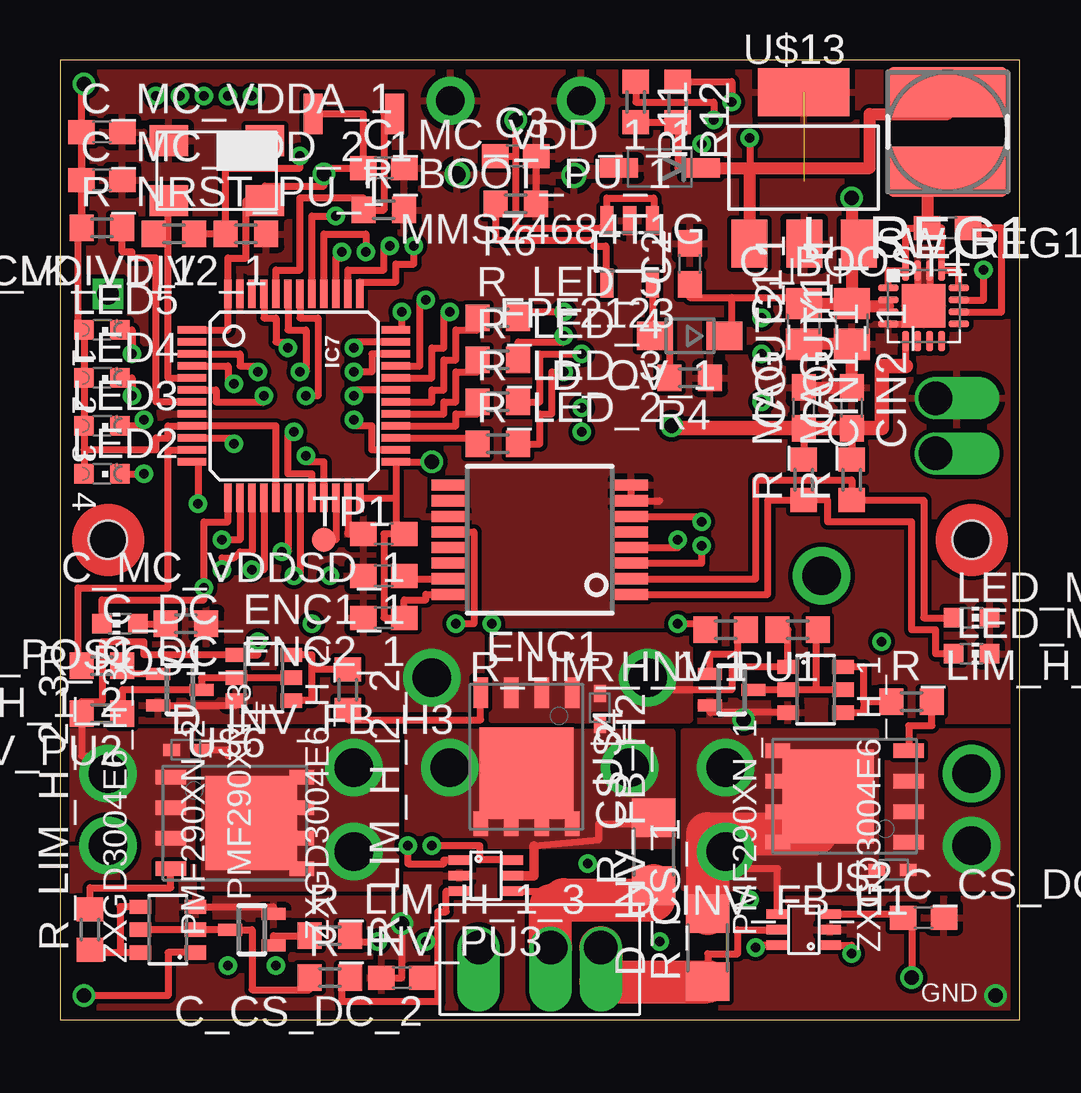
[diagram p17: board, top side]
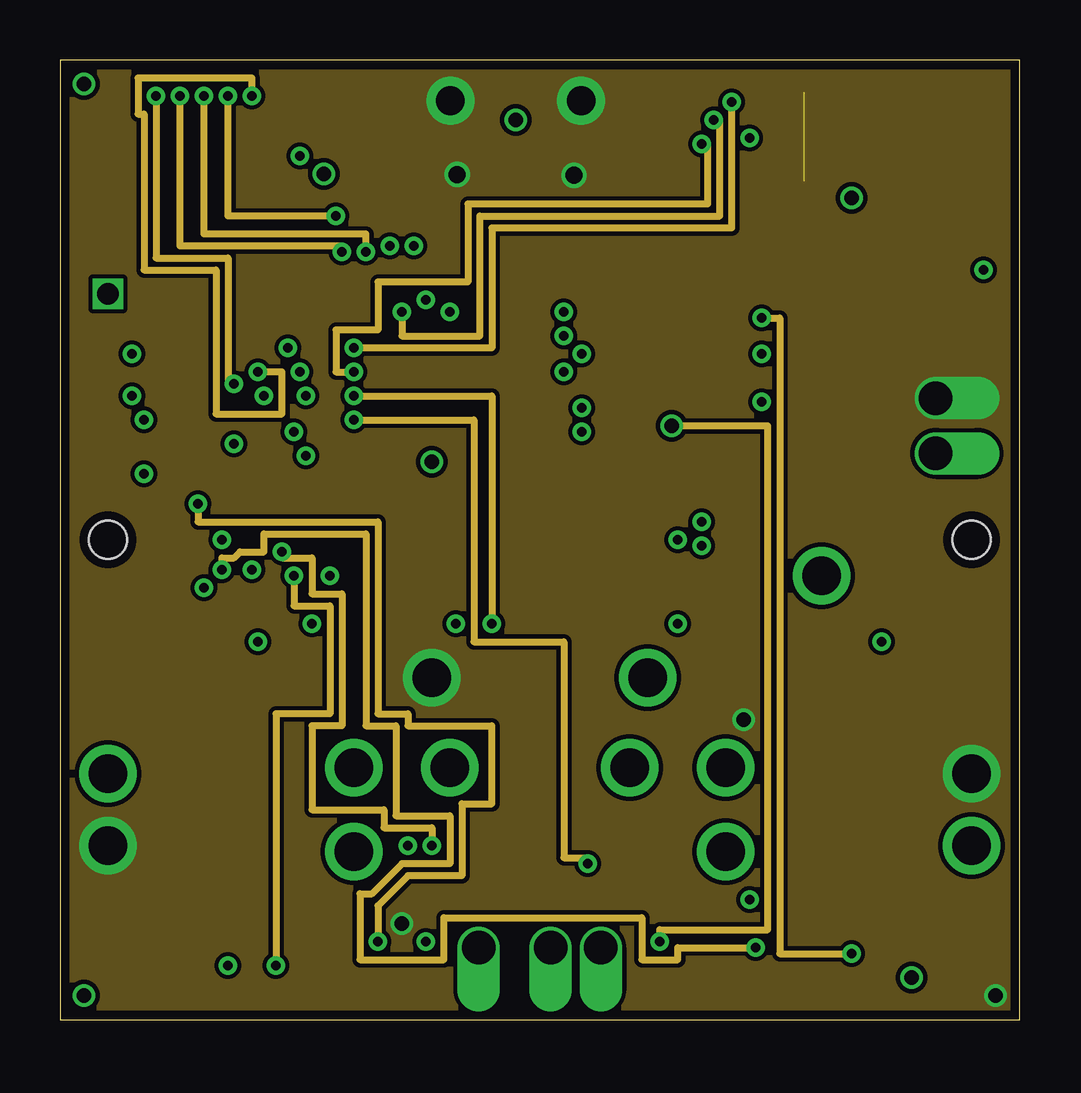
[diagram p18: board, inner layer Route2]
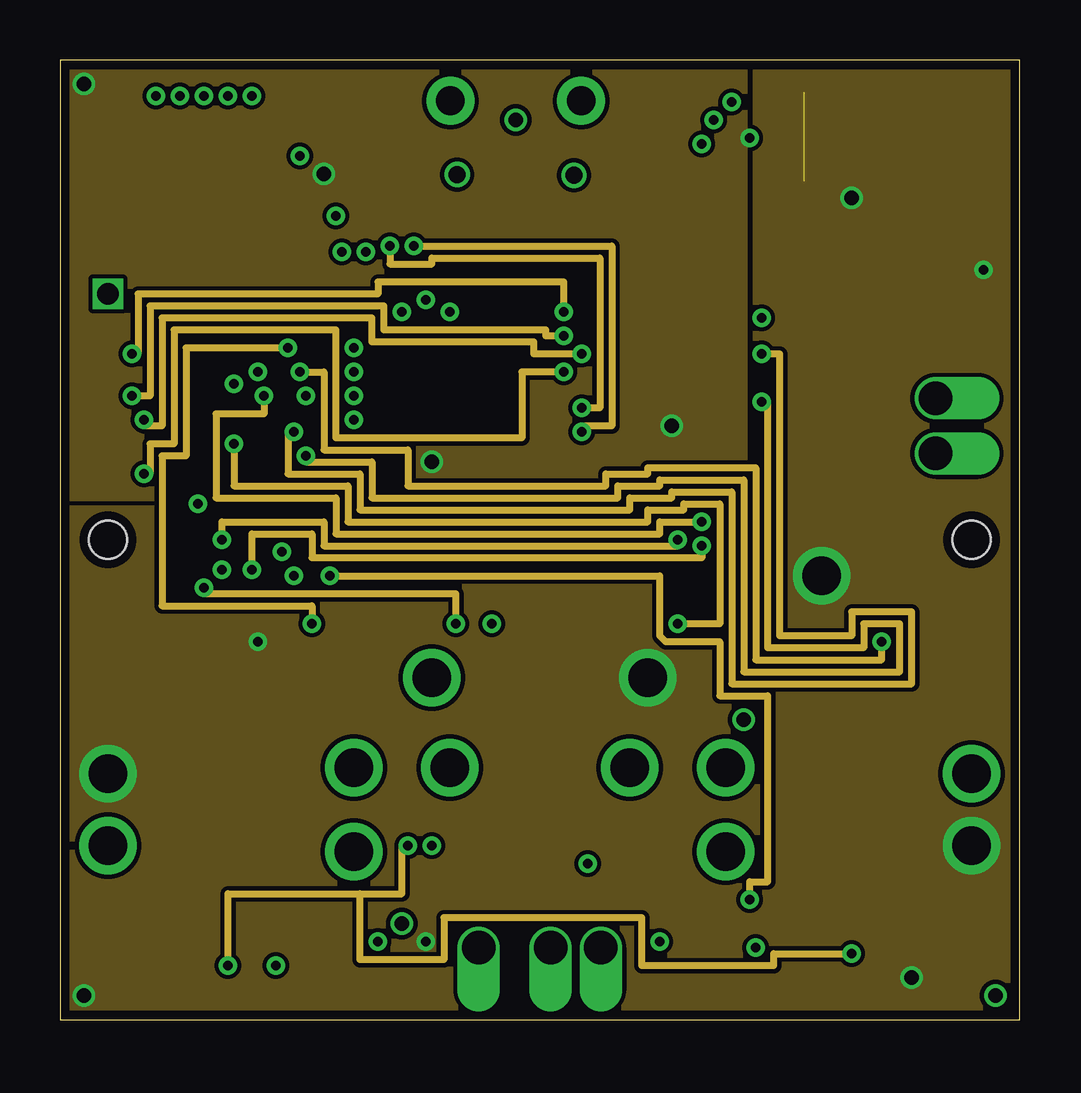
[diagram p19: board, inner layer Route15]
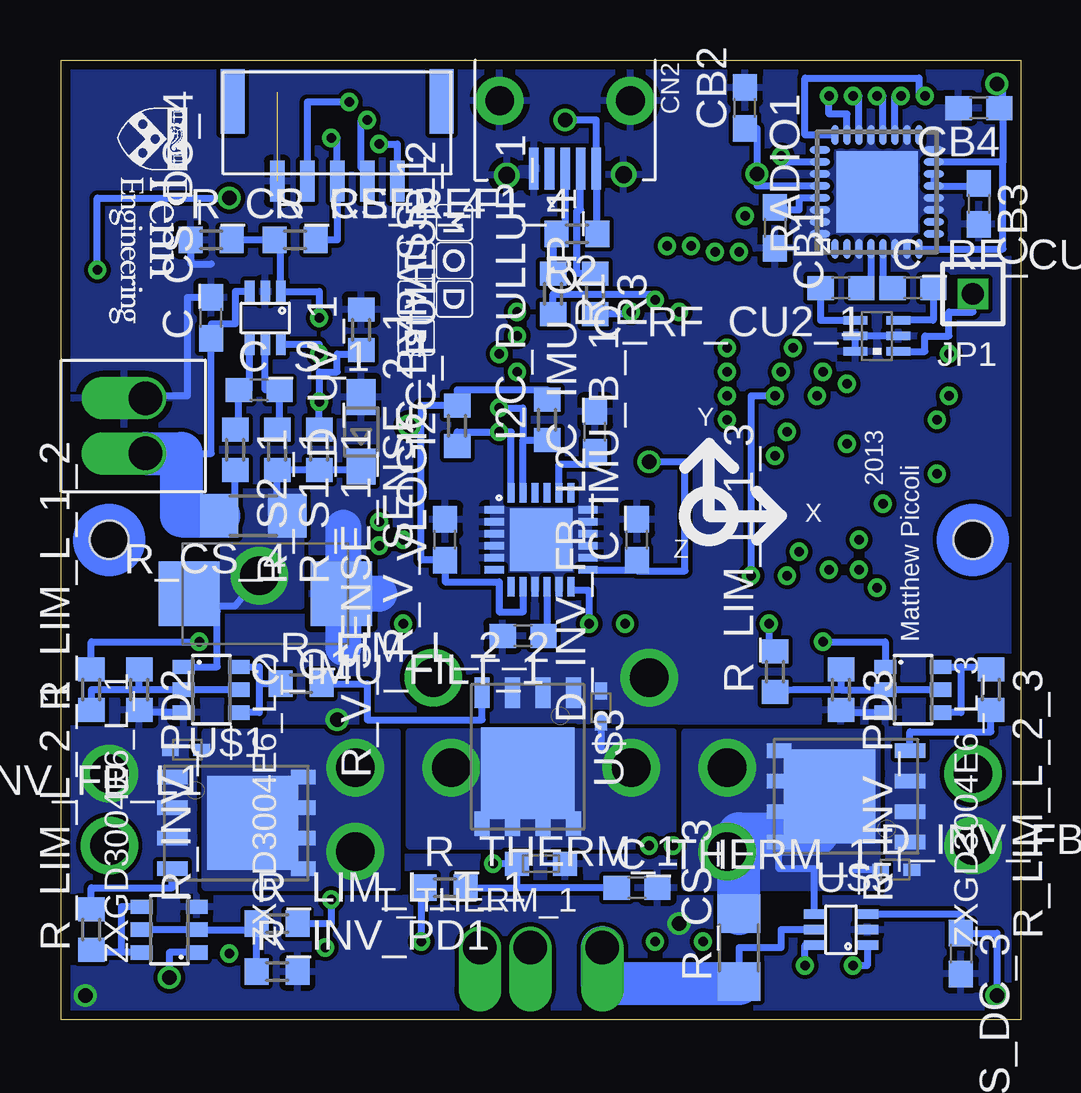
[diagram p20: board, bottom side, seen from below]

Size 40 x 40 mm. Coordinates in mm from the lower left corner, seen from the top.
Outline: 0,0 40,0 40,40 0,40 0,0
Copper layers (1*16): Top 0.0356mm / dielectric 1.5011mm / Bottom 0.0356mm
Design rules "LaenPCBOrder *": minimum track width 6mil, minimum drill 13mil, track to track 6mil, track to pad 6mil, pad to pad 6mil, via to via 6mil, smd to smd 6mil, copper to edge 15mil, drill to drill 6mil, minimum pad ring 7mil, minimum via ring 7mil, stop-mask expansion 4mil, vias tented up to drill 0mil, thermal gap 10mil
Holes 1.6 mm at 2,20 38,20

### Footprints (pad centres in the part's own frame; a part is rotated, then mirrored left to right if it is on the bottom)
0896FB15A0100 = smd 0.35 x 1: 1 -0.65,-0.9; 2 0,-0.9; 3 0.65,-0.9; 4 0.65,0.9; 5 0,0.9; 6 -0.65,0.9
D/7343-31R = smd 2.55 x 2.7: + 3.175,0; - -3.175,0
C0603 = smd 1.1 x 1: 1 -0.85,0; 2 0.85,0
C0805 = smd 1.3 x 1.5: 1 -0.85,0; 2 0.85,0
FCI-10103594-0001LF = smd 0.4 x 1.75: 1 -1.3,4.525; 2 -0.65,4.525; 3 0,4.525; 4 0.65,4.525; 5 1.3,4.525 | drill 0.7: P$1 -2.443,4.776; P$2 2.428,4.806 | drill 1.2 pad 2: P$3 -2.725,1.7; P$4 2.725,1.7
SC70 = smd 0.4 x 0.9: P1 -0.65,-1.1; P2 0,-1.1; P3 0.65,-1.1; P4 0.65,1.1; P5 0,1.1; P6 -0.65,1.1
SOD523 = smd 0.7 x 0.5: A 0.7,0; C -0.6,0
SOD323-W = smd 1.5 x 1.2: A 1.45,0; C -1.45,0
SSOP16 = smd 0.46 x 1.43: 1 -2.275,-3.795; 2 -1.625,-3.795; 3 -0.975,-3.795; 4 -0.325,-3.795; 5 0.325,-3.795; 6 0.975,-3.795; 7 1.625,-3.795; 8 2.275,-3.795; 9 2.275,3.795; 10 1.625,3.795; 11 0.975,3.795; 12 0.325,3.795; 13 -0.325,3.795; 14 -0.975,3.795; 15 -1.625,3.795; 16 -2.275,3.795
SOT23-5L = smd 0.55 x 1.2: 1 -0.95,-1.3; 2 0,-1.3; 3 0.95,-1.3; 4 0.95,1.3; 5 -0.95,1.3
R0603 = smd 1 x 1.1: 1 -0.85,0; 2 0.85,0
LQFP48 = smd 0.3 x 1.2: 1 -2.75,-4.25; 2 -2.25,-4.25; 3 -1.75,-4.25; 4 -1.25,-4.25; 5 -0.75,-4.25; 6 -0.25,-4.25; 7 0.25,-4.25; 8 0.75,-4.25; 9 1.25,-4.25; 10 1.75,-4.25; 11 2.25,-4.25; 12 2.75,-4.25; 25 2.75,4.25; 26 2.25,4.25; 27 1.75,4.25; 28 1.25,4.25; 29 0.75,4.25; 30 0.25,4.25; 31 -0.25,4.25; 32 -0.75,4.25; 33 -1.25,4.25; 34 -1.75,4.25; 35 -2.25,4.25; 36 -2.75,4.25 | smd 1.2 x 0.3: 13 4.25,-2.75; 14 4.25,-2.25; 15 4.25,-1.75; 16 4.25,-1.25; 17 4.25,-0.75; 18 4.25,-0.25; 19 4.25,0.25; 20 4.25,0.75; 21 4.25,1.25; 22 4.25,1.75; 23 4.25,2.25; 24 4.25,2.75; 37 -4.25,2.75; 38 -4.25,2.25; 39 -4.25,1.75; 40 -4.25,1.25; 41 -4.25,0.75; 42 -4.25,0.25; 43 -4.25,-0.25; 44 -4.25,-0.75; 45 -4.25,-1.25; 46 -4.25,-1.75; 47 -4.25,-2.25; 48 -4.25,-2.75
1X01M = drill 0.914 square: 1 0,0
VLC5045 = smd 5 x 2.1: 1 0,1.65; 2 0,-1.65
CHIPLED_0603 = smd 0.8 x 0.8: A 0,-0.75; C 0,0.75
CHIP-LED0603 = smd 0.8 x 0.8: A 0,-0.75; C 0,0.75
SOD123 = smd 1.6 x 0.8: 1 -1.7,0; 2 1.7,0
4-SMD_5X3.2 = smd 1.6 x 1.3: P$1 -2,-1.25; P$2 2,-1.25; P$3 2,1.25; P$4 -2,1.25
SOT323 = smd 0.5 x 1: 1 0,0.9; 2 -0.65,-0.9; 3 0.65,-0.9
R1206 = smd 1.6 x 1.803: 1 -1.422,0; 2 1.422,0
QFNN32 = smd 0.85 x 0.3: 1 -2.375,1.75; 2 -2.375,1.25; 3 -2.375,0.75; 4 -2.375,0.25; 5 -2.375,-0.25; 6 -2.375,-0.75; 7 -2.375,-1.25; 8 -2.375,-1.75; 17 2.375,-1.75; 18 2.375,-1.25; 19 2.375,-0.75; 20 2.375,-0.25; 21 2.375,0.25; 22 2.375,0.75; 23 2.375,1.25; 24 2.375,1.75 | smd 0.3 x 0.85: 9 -1.75,-2.375; 10 -1.25,-2.375; 11 -0.75,-2.375; 12 -0.25,-2.375; 13 0.25,-2.375; 14 0.75,-2.375; 15 1.25,-2.375; 16 1.75,-2.375; 25 1.75,2.375; 26 1.25,2.375; 27 0.75,2.375; 28 0.25,2.375; 29 -0.25,2.375; 30 -0.75,2.375; 31 -1.25,2.375; 32 -1.75,2.375 | smd 3.4 x 3.4: EXP 0,0
B3U = smd 0.8 x 1.7: P$1 -1.7,0; P$2 1.7,0
QFN16 = smd 0.85 x 0.3: 1 -1.475,0.75; 2 -1.475,0.25; 3 -1.475,-0.25; 4 -1.475,-0.75; 9 1.475,-0.75; 10 1.475,-0.25; 11 1.475,0.25; 12 1.475,0.75 | smd 0.3 x 0.85: 5 -0.75,-1.475; 6 -0.25,-1.475; 7 0.25,-1.475; 8 0.75,-1.475; 13 0.75,1.475; 14 0.25,1.475; 15 -0.25,1.475; 16 -0.75,1.475 | smd 1.8 x 1.8: TH 0,0
CT/CN0603 = smd 1 x 1: 1 -1,0; 2 1,0
TP10R = smd 1 x 1: TP 0,0
S0-8-POWERPAK = smd 1.27 x 0.61: 1 -2.627,1.85; 2 -2.627,0.58; 3 -2.627,-0.69; 4 -2.627,-1.96 | smd 1.016 x 0.61: 5 2.834,-1.96; 6 2.834,-0.69; 7 2.834,0.58; 8 2.834,1.85 | smd 3.81 x 3.912: P$1 0.726,-0.055
SM05B-GHS-TB = smd 1 x 2.7: MNT1 -4.35,1.225; MNT2 4.35,1.225 | smd 0.6 x 1.7: P$1 -2.5,4.55; P$2 -1.25,4.55; P$3 0,4.55; P$4 1.25,4.55; P$5 2.5,4.55
DEANS-MICRO-2PIN = drill 1.397 pad 1.778 offset: P$1 -1.15,0; P$2 1.15,0
DEANS-MICRO-3PIN = drill 1.397 pad 1.778 offset: P$1 -2.55,0; P$2 -0.45,0; P$3 2.55,0
QFN24 = smd 0.3 x 0.8: P$1 -1.25,-1.955; P$2 -0.75,-1.955; P$3 -0.25,-1.955; P$4 0.25,-1.955; P$5 0.75,-1.955; P$6 1.25,-1.955; P$13 1.25,1.955; P$14 0.75,1.955; P$15 0.25,1.955; P$16 -0.25,1.955; P$17 -0.75,1.955; P$18 -1.25,1.955 | smd 0.8 x 0.3: P$7 1.955,-1.25; P$8 1.955,-0.75; P$9 1.955,-0.25; P$10 1.955,0.25; P$11 1.955,0.75; P$12 1.955,1.25; P$19 -1.955,1.25; P$20 -1.955,0.75; P$21 -1.955,0.25; P$22 -1.955,-0.25; P$23 -1.955,-0.75; P$24 -1.955,-1.25 | smd 2.6 x 2.6: P$25 0,0
SOT-223 = smd 1.499 x 2.007: 1 -2.261,-3.15; 2 0.025,-3.15; 3 2.311,-3.15 | smd 3.81 x 2.007: 4 0,3.15
SOT23-6 = smd 0.6 x 0.9: 1 -0.95,-1.15; 2 0,-1.15; 3 0.95,-1.15; 4 0.95,1.15; 5 0,1.15; 6 -0.95,1.15

### Placement (x,y rotation side)
BALUN1  6,28.5 90 bottom
C1  31.5,17.75 180 bottom
C2  26.25,31.5 90 top
C3  19,36 0 top
C_BOOST1  37,33 180 top
C_CS_DC_1  36,4.25 0 top
C_CS_DC_2  14.25,1.75 180 top
C_CS_DC_3  2.5,2.75 270 bottom
C_CS_DC_4  33.75,29.25 90 bottom
C_DC_ENC1_1  13.5,18.5 180 top
C_DC_ENC2_1  13.5,16.75 180 top
C_IMU_B_1  16,20 90 bottom
C_IMU_CP_1  17.75,24.5 90 bottom
C_IMU_FILT_1  20.75,16 180 bottom
C_MC_VDD_1_1  13.5,35.5 0 top
C_MC_VDD_2_1  1.75,35 0 top
C_MC_VDDA_1  1.75,37 0 top
C_MC_VDDSD_1  13.5,20.25 180 top
C_RF_CU1_1  4.5,30.5 0 bottom
C_RF_CU2_1  7.5,30.5 180 bottom
C_S_1  31.75,26.25 0 bottom
C_THERM_1  16,5.5 0 bottom
CB1  10.25,33 270 bottom
CB2  11.5,38 90 bottom
CB3  1.75,34 270 bottom
CB4  1.75,38 180 bottom
CIN1_1  31,29 270 top
CIN2_1  33,29 270 top
CN2  19,40 180 bottom
COUT1_1  33,25.5 90 top
COUT2_1  31,25.5 90 top
CS_1  31,3.75 90 top
CS_2  17.75,6 270 top
CS_3  7.5,3.75 90 bottom
CS_4  31.5,29.25 180 bottom
D_INV_FB_H1  34.75,6.25 180 top
D_INV_FB_H2  22.5,13 270 top
D_INV_FB_H3  5.25,11.25 0 top
D_INV_FB_L1  34.75,11.25 180 bottom
D_INV_FB_L2  17.5,13 90 bottom
D_INV_FB_L3  5.25,6.25 0 bottom
D_OV_1  26.25,28.5 180 top
D_UV_1  27.5,24.5 90 bottom
ENC1  20,20 90 top
FPF2123  23.75,32 180 top
I2C_PULLUP_1  19.75,25 90 bottom
I2C_PULLUP_2  23.5,24.75 90 bottom
IC7  9.75,26 270 top
JP1  2,30.25 90 bottom
L_REG1  37,37 180 top
LED2  1.75,22.75 270 top
LED3  1.75,24.75 270 top
LED4  1.75,26.75 270 top
LED5  1.75,28.75 270 top
LED_MAG_G1  38,15.25 270 top
LED_MAG_Y1  38,16.75 270 top
LED_POS1  2.5,16.5 90 top
MMSZ4684T1G  25,35.5 180 top
OSC1  6.54,35.38 180 top
PMF290XN_1  28,13.75 270 top
PMF290XN_2  5,13.75 270 top
PMF290XN_3  8,3.75 90 top
R1  19.5,30.25 270 bottom
R2  18.5,32.75 180 bottom
R3  17.75,30.25 270 bottom
R4  26.25,26.75 180 top
R6  19,34 180 top
R11  24,38.25 270 top
R12  25.75,38.25 270 top
R_BOOT_PU_1  13.5,33.75 0 top
R_CLK_VDIV1_1  4.75,32.75 180 top
R_CLK_VDIV2_1  7.75,32.75 180 top
R_CS_1  27,3 90 top
R_CS_2  24.75,7 90 top
R_CS_3  11.75,3 90 bottom
R_CS_4  32,21 180 bottom
R_CS_REF1_4  30.25,32.5 0 bottom
R_CS_REF2_4  33.75,32.5 0 bottom
R_INV_PD1  31,2 0 bottom
R_INV_PD2  36.75,13.75 270 bottom
R_INV_PD3  7.5,13.75 270 bottom
R_INV_PU1  30.75,16.25 180 top
R_INV_PU2  1.75,12.75 180 top
R_INV_PU3  11.25,1.75 0 top
R_LED_2  18.25,24 0 top
R_LED_3  18.25,25.75 0 top
R_LED_4  18.25,27.5 0 top
R_LED_5  18.25,29.25 0 top
R_LIM_H_1_1  27.75,16.25 180 top
R_LIM_H_1_2  1.75,14.75 180 top
R_LIM_H_1_3  11.25,3.5 0 top
R_LIM_H_2_1  35.5,13.25 0 top
R_LIM_H_2_2  12,13.75 270 top
R_LIM_H_2_3  1.25,3.75 90 top
R_LIM_L_1_1  31,4 0 bottom
R_LIM_L_1_2  38.75,13.75 90 bottom
R_LIM_L_1_3  10.25,14.5 90 bottom
R_LIM_L_2_1  38.75,3.75 90 bottom
R_LIM_L_2_2  30,14 0 bottom
R_LIM_L_2_3  1.25,13.75 270 bottom
R_MAG_G1  31,22.5 90 top
R_MAG_Y1  33,22.5 90 top
R_NRST_PU_1  1.75,33 0 top
R_POS1  5.25,16.5 180 top
R_S1_1  31,23.75 270 bottom
R_S2_1  32.75,23.75 270 bottom
R_THERM_1  24,5.5 0 bottom
R_V_SENSE_1_1  29.25,23.75 270 bottom
R_V_SENSE_2_1  27.5,28.75 270 bottom
RADIO1  6,34.5 90 bottom
SW1  12.25,37.75 180 top
SW_REG1  36,29.75 0 top
T_THERM_1  20,6.5 180 bottom
TP1  11,20 0 top
U$1  32.75,8.25 0 bottom
U$2  32.75,9.25 180 top
U$3  20.5,11 270 bottom
U$4  19.5,11 270 top
U$5  7.25,9.25 180 bottom
U$6  7.25,8.25 0 top
U$7  28.5,39.5 180 bottom
U$8  36.5,24.75 90 bottom
U$9  20,3 180 top
U$10  20,20 270 bottom
U$11  [PENN_ENGINEERING]  38,38 270 bottom
U$12  [MODLAB]  26,34 270 bottom
U$13  31,35.5 0 top
VLOGIC_BYPASS_1  24,20 90 bottom
ZXGD3004E6_H_1  31.5,13.75 270 top
ZXGD3004E6_H_2  8.5,14.25 270 top
ZXGD3004E6_H_3  4.5,3.75 90 top
ZXGD3004E6_L_1  35.5,3.75 90 bottom
ZXGD3004E6_L_2  33.75,13.75 270 bottom
ZXGD3004E6_L_3  4.5,13.75 270 bottom

### Tracks (layer width: path | path; a pad name or v marks a point on that pad's centre or on a via)
16MHZ_0V5_1  (via drill 0.4)
  Top 0.3: R_CLK_VDIV1_1.1 R_CLK_VDIV2_1.2 6.9,35.5 10,35.5 v10,36
  Bottom 0.3: RADIO1.26 10,35.75 v10,36
16MHZ_3V3
  Top 0.3: IC7.5 4.5,26.75 4.5,33 | 4.5,33 R_CLK_VDIV1_1.2 | 4.5,33 4.5,34.63 OSC1.P$3
+3V3  (via drill 0.4, 0.6)
  Top 0.3: 35.25,27.25 SW_REG1.5 | 0.5,37.25 C_MC_VDDA_1.1 C_MC_VDD_2_1.1 R_NRST_PU_1.1 | SW1.P$2 12.65,37.75 C_MC_VDD_1_1.1 11,35.5 v11,35.25 11,34.75 8.54,34.75 OSC1.P$4 7.75,34.13 7.75,31.75 7,31.75 IC7.48 7,28.75 IC7.1 | 14,21.75 IC7.25 v15.5,23.25 | 14,21.75 14,20.25 C_MC_VDDSD_1.1 13.5,20.25 13.5,16.75 C_DC_ENC2_1.1 14.35,17.5 15.25,17.5 15.25,17.73 ENC1.16 | IC7.24 14,21.75 | 32.85,24.65 COUT1_1.1 R_MAG_Y1.2 | 1,23.75 LED3.A LED4.A LED5.A 0.75,28.75 0.75,33 R_NRST_PU_1.1 | 1,23.75 LED2.A | 1,23.75 4,23.75 4,24.25 4.5,24.25 4.5,24.75 IC7.9 9,24.75 IC7.17 | R_NRST_PU_1.1 0.9,39 v1,39 | COUT2_1.1 R_MAG_G1.2 | 25.5,24.65 v25.5,24.75 | R11.2 R12.2 25.75,35.5 MMSZ4684T1G.1 | v28.75,36.75 28.75,35.5
  Top 0.5: MMSZ4684T1G.1 28.74,35.5 | 28.74,35.5 U$13.1 | 28.74,35.5 28.75,35.5 33.75,35.5 33.75,37.75 37,37.75 L_REG1.2
  Top 0.6: 35.25,27.25 34.25,27.25 34.25,24.65 COUT1_1.1 COUT2_1.1 25.5,24.65
  Route2 0.3: v25.5,24.75 29.5,24.75 29.5,3.75 25,3.75 v25,3.25
  Bottom 0.3: 0.75,35.75 RADIO1.15 | RADIO1.8 0.75,32.12 0.75,35.75 | v1,39 0.75,39 0.75,38 | 0.75,38 0.75,35.75 | 25,24.75 25,19.15 VLOGIC_BYPASS_1.1 24,18.25 21.75,18.25 21.75,17 20.75,17 U$10.P$8 | RADIO1.28 11,34.75 v11,35.25 11,37.15 CB2.1 | R_THERM_1.1 25,5.5 v25,3.25 | 25,24.75 25,25.6 I2C_PULLUP_2.2 23.5,26.25 19.75,26.25 I2C_PULLUP_1.2 | 25,24.75 v25.5,24.75 | CB4.1 0.75,38 | v15.5,23.25 IC7.25 14,18.7 16,18.7 C_IMU_B_1.1 16,18.75 U$10.P$13 | R_CS_REF1_4.2 28.5,32.5 U$7.P$3 28.5,36.75 v28.75,36.75
  pour Route15: 0,40 28.5,40 28.5,21.75 0,21.75
+5V  (via drill 0.6)
  Top 0.3: C3.1 19,36 | 19,36 v19,37.5 | 19,36 19,33 22.55,33 FPF2123.3 22.8,34.25 24.75,34.25 24.75,33.3 FPF2123.1
  Bottom 0.3: R2.1 17.7,32.75 CN2.1 17.7,37.5 v19,37.5
ANT1
  Bottom 0.3: BALUN1.1 4,27.85 4,28.5 3,28.5 3,29.5 2,29.5 JP1.1
BOOST1
  Top 0.3: SW_REG1.10 39.25,29.5 39.25,33 C_BOOST1.1
BOOT0_1
  Top 0.3: SW1.P$1 13.5,37.75 13.5,33.75 R_BOOT_PU_1.1 12.65,34.25 10,34.25 10,31.25 9,31.25 IC7.44
CPOUT_1
  Bottom 0.3: C_IMU_CP_1.1 17.75,23.15 19,23.15 19.22,23.15 19.25,23.15 U$10.P$20
CS_OUT_1  (via drill 0.4)
  Top 0.3: IC7.15 8,19.5 7.5,19.5 7.25,19.25 6.75,19.25 v6.75,18.75 | CS_1.P6 29,3.1 v29,3
  Route2 0.3: v6.75,18.75 6.75,19.25 7.25,19.25 7.5,19.5 8.5,19.5 8.5,20.25 12.75,20.25 12.75,12.25 14,12.25 14,8.5 16.25,8.5 16.25,6.5 14.25,6.5 13,5.25 12.5,5.25 12.5,2.5 16,2.5 16,4.25 24.25,4.25 24.25,2.5 25.75,2.5 25.75,3 v29,3
CS_OUT_2  (via drill 0.4)
  Top 0.3: IC7.18 9.5,19.5 v9.25,19.5 | CS_2.P6 17.5,6.65 17.5,7.25 v15.5,7.25
  Route2 0.3: v9.25,19.5 9.25,19.25 10.5,19.25 10.5,17.75 11.75,17.75 11.75,12.25 10.5,12.25 10.5,8.75 13.5,8.75 13.5,8 15.5,8 v15.5,7.25
CS_OUT_3  (via drill 0.4)
  Top 0.3: IC7.19 10,18.5 v9.75,18.5
  Route2 0.3: v9,2.25 9,12.75 11.25,12.75 11.25,17.25 9.75,17.25 v9.75,18.5
  Bottom 0.3: v9,2.25 9,3.1 CS_3.P6
CS_OUT_4  (via drill 0.4)
  Top 0.3: IC7.20 10.5,22.75 9.5,22.75 9.5,24.5 v9.75,24.5
  Route15 0.3: v9.75,24.5 9.5,24.5 9.5,22.75 12.5,22.75 12.5,21.25 23.75,21.25 23.75,21.75 25.5,21.75 25.5,22 28,22 28,14 35.5,14 35.5,17 33,17 33,16 30,16 30,27.75 v29.25,27.75
  Bottom 0.3: CS_4.P6 29.25,28.15 v29.25,27.75
D+1  (via drill 0.4)
  Top 0.3: IC7.33 15,27.25 15,30 v15.25,30
  Bottom 0.3: R1.2 19.5,30.25 15.25,30.25 v15.25,30
D+_IN_1
  Bottom 0.3: CN2.3 19,32.75 R2.2 19.5,32.75 R1.1
D-1  (via drill 0.4)
  Top 0.3: IC7.32 15.5,26.75 15.5,28 16,28 16,29.5 v16.25,29.5
  Bottom 0.3: v16.25,29.5 16.25,29.4 R3.2
D-_IN_1
  Bottom 0.3: R3.1 18.5,31.1 18.5,33.75 18.35,33.75 CN2.2
ENC_3V3_1
  Top 0.3: C_DC_ENC1_1.1 14.35,18.38 ENC1.15
GATE_DRV_HIGH_IN1
  Top 0.3: ZXGD3004E6_H_1.5 31.5,13.75 | 31.5,13.75 ZXGD3004E6_H_1.2 PMF290XN_1.1 | 31.5,13.75 31.5,16.25 R_INV_PU1.1
GATE_DRV_HIGH_IN2
  Top 0.3: ZXGD3004E6_H_2.5 ZXGD3004E6_H_2.2 5.9,14.25 PMF290XN_2.1 2.6,13.75 R_INV_PU2.1
GATE_DRV_HIGH_IN3
  Top 0.3: ZXGD3004E6_H_3.5 ZXGD3004E6_H_3.2 PMF290XN_3.1 8,3.75 8,1.25 10.4,1.25 R_INV_PU3.1
GATE_DRV_LOW_IN1
  Bottom 0.3: ZXGD3004E6_L_1.5 ZXGD3004E6_L_1.2 31.85,3.75 R_LIM_L_1_1.1 R_INV_PD1.1
GATE_DRV_LOW_IN2
  Bottom 0.3: ZXGD3004E6_L_2.5 ZXGD3004E6_L_2.2 36.75,13.75 | 36.75,13.75 R_INV_PD2.1 | 36.75,13.75 38.75,13.75 R_LIM_L_1_2.1
GATE_DRV_LOW_IN3
  Bottom 0.3: R_INV_PD3.1 7.5,13.75 | 7.5,13.75 ZXGD3004E6_L_3.2 ZXGD3004E6_L_3.5 | 7.5,13.75 9.5,13.75 R_LIM_L_1_3.1
GND  (via drill 0.6, 1.6)  (1 unrouted)
  Top 0.3: ZXGD3004E6_H_3.3 8.9,4.7 PMF290XN_3.3 | ZXGD3004E6_H_1.3 27.1,12.8 PMF290XN_1.3 | SW_REG1.15 35.75,29.75 SW_REG1.TH | SW_REG1.14 36.25,29.75 SW_REG1.TH | SW_REG1.4 36,29 SW_REG1.TH | ENC1.8 ENC1.7 25,21.62 | C3.2 R6.1 | PMF290XN_2.3 7.35,13.1 ZXGD3004E6_H_2.3 | C_CS_DC_2.2 14.25,1.75 v14.25,4 | IC7.23 12,20.25 12.75,20.25
  Top 0.5: COUT2_1.2 COUT1_1.2 CIN2_1.2 CIN1_1.2
  Bottom 0.3: R_INV_PD3.2 7.5,12.8 ZXGD3004E6_L_3.3 | ZXGD3004E6_L_2.3 36.75,12.8 R_INV_PD2.2 | R_CS_REF2_4.1 34.6,31.5 33.75,31.5 | C_CS_DC_4.2 34.75,30.1 34.75,26 36.5,26 U$8.P$2 | BALUN1.2 BALUN1.5 BALUN1.6 | T_THERM_1.1 19,6.25
  Bottom 1.5: 28.25,20.5 28.25,17.75 | 28.25,17.75 28.25,15.5 | 26.75,17.75 28.25,17.75
  other vias: 39,1 28.5,12.5 2,7.25 15.5,14.25 38,10.25
  pour Route2 (no thermals): 0,40 40,40 40,0 0,0
  pour Top (rank 2): 0,40 40,40 40,0 0,0
  pour Bottom (rank 2): 0,40 40,40 40,0 0,0
  pour Bottom (no thermals): 5.5,12 0.5,12 0.5,5.5 5.5,5.5
  pour Bottom (no thermals): 40,12 34.5,12 34.5,5.5 40,5.5
  pour Bottom (no thermals): 14,14.75 14,12.5 22.25,12.5 22.25,14.75
  pour Bottom (no thermals): 2.75,37.75 9,37.75 9,31.5 2.75,31.5
  pour Bottom (no thermals): 18,22 22,22 22,18 18,18
IMU_IRQ_1  (via drill 0.4)
  Top 0.3: IC7.31 12.25,26.25 v12.25,26
  Route2 0.3: v12.25,26 18,26 v18,16.5
  Bottom 0.3: v18,16.5 18,17.88 18.75,17.88 U$10.P$12
IMU_SCL_1  (via drill 0.4)
  Top 0.3: IC7.38 12,31.25 13.5,31.25 13.5,32.25 v13.75,32.25
  Route15 0.3: v13.75,32.25 13.75,31.5 15.5,31.5 15.5,31.75 22.5,31.75 22.5,25.5 v21.75,25.5
  Bottom 0.3: 20.75,24.15 I2C_PULLUP_1.1 | v21.75,25.5 20.76,25.5 20.76,24.15 20.75,24.15 | U$10.P$23 20.75,24.15
IMU_SDA_1  (via drill 0.4)
  Top 0.3: IC7.37 12.5,30.75 14,30.75 14,31.5 14.75,31.5 v14.75,32.25
  Route15 0.3: v14.75,32.25 23,32.25 23,24.75 21.75,24.75 v21.75,24.5
  Bottom 0.3: I2C_PULLUP_2.1 23.5,24.5 v21.75,24.5 21.25,24.5 U$10.P$24
IN+_1
  Bottom 0.3: R_S2_1.1 32.6,24.6 C_S_1.1 32.15,26.25 CS_4.P4
IN-_1
  Bottom 0.3: R_S1_1.1 30.9,24.6 C_S_1.2 31.5,26.25 CS_4.P5
INDEX1  (via drill 0.4)
  Top 0.3: IC7.6 6.5,26.25 6.5,25.75 8.5,25.75 v8.5,26 | ENC1.6 26.75,20.98 v26.75,20.75
  Route15 0.3: v8.5,26 8.5,25.25 6.5,25.25 6.5,21.75 11.5,21.75 11.5,20.25 25,20.25 25,20.75 v26.75,20.75
INV_HIGH_GATE1
  Top 0.3: U$2.4 35.38,12.25 36.35,12.25 R_LIM_H_2_1.2
INV_HIGH_GATE2
  Top 0.3: U$4.4 17.54,12.5 12,12.5 R_LIM_H_2_2.2
INV_HIGH_GATE3
  Top 0.3: R_LIM_H_2_3.2 1.25,5.5 4.62,5.5 U$6.4
INV_HIGH_GSS1
  Top 0.3: ZXGD3004E6_H_1.4 33.5,12.8 33.5,13 33.5,13.25 | 33.5,13.25 33.5,14.7 ZXGD3004E6_H_1.6 | R_LIM_H_2_1.1 33.5,13.25
INV_HIGH_GSS2
  Top 0.3: 10.5,14.6 10.5,13.3 ZXGD3004E6_H_2.4 | ZXGD3004E6_H_2.6 10.5,15.2 10.5,15 10.5,14.6 | R_LIM_H_2_2.1 10.5,14.6
INV_HIGH_GSS3
  Top 0.3: ZXGD3004E6_H_3.4 2.5,4.7 2.5,2.8 | 2.5,2.8 ZXGD3004E6_H_3.6 | R_LIM_H_2_3.1 1.25,2.8 2.5,2.8
INV_LOW_GATE1
  Bottom 0.3: R_LIM_L_2_1.2 38.75,5.5 35.38,5.5 U$1.4
INV_LOW_GATE2
  Bottom 0.3: U$3.4 22.46,12.5 27.25,12.5 27.25,14 R_LIM_L_2_2.2
INV_LOW_GATE3
  Bottom 0.3: U$5.4 4.62,12 1.25,12 R_LIM_L_2_3.2
INV_LOW_GSS1
  Bottom 0.3: ZXGD3004E6_L_1.6 37.5,2.8 | 37.5,2.8 37.5,4.7 ZXGD3004E6_L_1.4 | 37.5,2.8 38.75,2.8 R_LIM_L_2_1.1
INV_LOW_GSS2
  Bottom 0.3: ZXGD3004E6_L_2.6 31.75,14.7 31.75,14 | 31.75,14 31.75,12.8 ZXGD3004E6_L_2.4 | R_LIM_L_2_2.1 31.75,14
INV_LOW_GSS3
  Bottom 0.3: ZXGD3004E6_L_3.6 2.5,14.7 | 2.5,14.7 2.5,12.8 ZXGD3004E6_L_3.4 | 2.5,14.7 1.25,14.7 R_LIM_L_2_3.1
INV_OUT1  (via drill 1.6)
  Top 0.3: CS_1.P4 29.92,4.4 U$1.5 27.75,6.29 v27.75,7
  Top 1.8: R_CS_1.2 27,7.75 31.5,7.75
  other vias: 27.75,10.5
  pour Bottom (no thermals): 34,12 26,12 26,5.5 34,5.5
  pour Top (no thermals): 34,12 26,12 26,5.5 34,5.5
INV_OUT2  (via drill 1.6)
  Top 0.3: 19.75,7.25 22.46,7.5 U$3.5 24.75,8.17 R_CS_2.2
  Top 0.4: CS_2.P5 19.75,6 19.75,7.25
  Bottom 0.3: D_INV_FB_L2.C 17.5,11.25
  other vias: 16.25,10.5 23.75,10.5
  pour Top (no thermals): 14.5,12 25.5,12 25.5,7.25 14.5,7.25
  pour Bottom (no thermals): 14.5,12 25.5,12 25.5,7.25 14.5,7.25
INV_OUT3  (via drill 1.6)
  Top 0.3: D_INV_FB_H3.A 7,11.25 7,11
  Bottom 0.3: D_INV_FB_L3.C 7,6.25 | CS_3.P4 8.6,6.29 U$6.5 10.08,7 11.75,7
  Bottom 1.8: R_CS_3.2 11.75,7 11.75,7.75 8.5,7.75
  other vias: 12.25,10.5 12.25,7
  pour Bottom (no thermals): 6,5.5 14,5.5 14,12 6,12
  pour Top (no thermals): 6,5.5 14,5.5 14,12 6,12
LOAD_ISET_1
  Top 0.3: R6.2 18.15,32.5 22.25,32.5 22.25,32.25 22.75,32.25 22.75,30.45 FPF2123.4
MAGDEC1
  Top 0.3: ENC1.2 29,18.38 29,22.5 33,22.5 R_MAG_Y1.1 36,21.65 36,16.75 LED_MAG_Y1.A
MAGINC1
  Top 0.3: ENC1.1 29.5,17.73 29.5,21.65 R_MAG_G1.1 32,21.65 32,20.75 35.5,20.75 35.5,16.25 36.5,16.25 36.5,15.25 LED_MAG_G1.A
MBUS_INT_1  (via drill 0.4)
  Top 0.3: IC7.34 13,27.75 13,27 v12.25,27
  Route2 0.3: v12.25,27 11.5,27 11.5,28.75 13.25,28.75 13.25,30.75 17,30.75 17,34 27,34 27,36.5 v26.75,36.5
  Bottom 0.3: v26.75,36.5 26,36.5 U$7.P$1
MBUS_SCL_1  (via drill 0.4)
  Top 0.3: IC7.35 12.25,28.25 v12.25,28 | R12.1 28,39.1 v28,38.25
  Route2 0.3: v12.25,28 18,28 18,33 28,33 v28,38.25
  Bottom 0.3: v28,38.25 29.75,38.25 U$7.P$4
MBUS_SDA_1  (via drill 0.4)
  Top 0.3: IC7.36 14.25,28.75 v14.25,29.5 | R11.1 24,38.25 27.25,38.25 v27.25,37.5
  Route2 0.3: v14.25,29.5 14.25,28.5 17.5,28.5 17.5,33.5 27.5,33.5 27.5,37.5 v27.25,37.5
  Bottom 0.3: v27.25,37.5 27.5,37.5 27.5,35.5 27.25,35.5 U$7.P$2
MOTOR_1
  Top 0.3: R_CS_1.1 27,2.75 28.25,2.75 28.25,3.75 CS_1.P5
  Top 1.8: U$9.P$1 22.55,1.58 R_CS_1.1
MOTOR_2
  Top 0.3: CS_2.P4 21,5.35 21,5
  Top 1.8: U$9.P$2 20.45,4.75 21,5 24.75,5 R_CS_2.1
MOTOR_3
  Bottom 0.3: 11.75,1.5 R_CS_3.1 11.75,3 10,3 10,3.75 CS_3.P5
  Bottom 1.8: 11.75,1.5 17.45,1.5 U$9.P$3
N$1
  Top 0.3: PMF290XN_2.2 2.6,14.4 R_LIM_H_1_2.1
N$2
  Top 0.3: PMF290XN_3.2 8.9,3.5 R_LIM_H_1_3.1
N$3  (via drill 0.4)
  Top 0.3: IC7.21 11,23.25 10.25,23.25 v10.25,23.5
  Route15 0.3: v10.25,23.5 10.25,23.25 13,23.25 13,21.75 23.25,21.75 23.25,22.25 25,22.25 25,22.5 28.5,22.5 28.5,14.5 35,14.5 35,16.5 33.5,16.5 33.5,15.5 29.5,15.5 29.5,25.75 v29.25,25.75
  Bottom 0.3: R_V_SENSE_1_1.1 v29.25,25.75 29.25,27 28.5,27 28.5,27.75 27.5,27.75 R_V_SENSE_2_1.2
N$5  (via drill 0.4)
  Top 0.3: LED2.C v3.5,22.75 | R_LED_2.2 20,24 20,25.25 20.5,25.25 20.5,27 v21,27
  Route15 0.3: v21,27 19.25,27 19.25,24.25 11.5,24.25 11.5,28.75 4.75,28.75 4.75,24 3.75,24 3.75,22.75 v3.5,22.75
N$6  (via drill 0.4)
  Top 0.3: R_LED_3.2 20,25.75 20,27.75 v21.75,27.75 | v3.5,25 3.5,24.75 LED3.C
  Route15 0.3: v21.75,27.75 19.75,27.75 19.75,28.25 13,28.25 13,29.25 4.25,29.25 4.25,24.75 3.5,24.75 v3.5,25
N$8
  Top 0.3: IC7.27 17.4,24.25 R_LED_2.1
N$9
  Top 0.3: IC7.28 16.5,24.75 16.5,25.25 17.4,25.25 R_LED_3.1
N$10  (via drill 0.4)
  Top 0.3: LED4.C 3,26.75 v3,26 | R_LED_4.2 19.1,28.25 21,28.25 v21,28.5
  Route15 0.3: v21,28.5 20.25,28.5 20.25,28.75 13.5,28.75 13.5,29.75 3.75,29.75 3.75,26 v3,26
N$11  (via drill 0.4)
  Top 0.3: LED5.C 3,28.75 v3,27.75 | v21,29.5 19.1,29.5 R_LED_5.2
  Route15 0.3: v21,29.5 21,30.75 13.25,30.75 13.25,30.25 3.25,30.25 3.25,27.75 v3,27.75
N$12
  Top 0.3: IC7.29 16,25.25 16,25.75 16.5,25.75 16.5,27 17.4,27 R_LED_4.1
N$13
  Top 0.3: IC7.30 15.5,25.75 15.5,26.25 16,26.25 16,27.5 16.5,27.5 16.5,28.75 17.4,28.75 R_LED_5.1
N$15
  Top 0.3: LED_POS1.A R_POS1.2 4.5,16.5
N$17
  Top 0.3: 24.95,28.5 D_OV_1.A | D_OV_1.A 25.4,28.5 R4.2 | FPF2123.5 24.7,28.5 D_OV_1.A
N$18
  Top 0.3: IC7.22 11.5,20 TP1.TP
N$30
  Top 0.3: PMF290XN_1.2 27.1,15.25 28.25,15.25 28.25,16.25 R_LIM_H_1_1.1
NRST_1
  Top 0.3: IC7.7 4,25.75 4,31.75 3,31.75 3,32 2.6,32 R_NRST_PU_1.2
POS_PWM1  (via drill 0.4)
  Top 0.3: LED_POS1.C 1.75,17.5 6,17.5 v6,18 6,20.75 7,20.75 IC7.13 | ENC1.12 17.25,20.32 17.25,16.5 v16.5,16.5
  Route15 0.3: v16.5,16.5 16.5,17.75 6,17.75 v6,18
PWM_H_1  (via drill 0.4)
  Top 0.3: IC7.10 7.25,24.25 v7.25,24 | R_LIM_H_1_1.2 26.9,16.5 v25.75,16.5
  Route15 0.3: v7.25,24 7.25,22.25 12,22.25 12,20.75 24.5,20.75 24.5,21.25 26,21.25 26,21.5 27.5,21.5 27.5,16.5 v25.75,16.5
PWM_H_2
  Top 0.3: IC7.11 4.5,23.75 4.5,18 0.75,18 0.75,14.75 R_LIM_H_1_2.2
PWM_H_3  (via drill 0.4)
  Top 0.3: R_LIM_H_1_3.2 12.1,3.25 v13.25,3.25 | IC7.12 5.75,23.25 v5.75,21.5
  Route2 0.3: v13.25,3.25 13.25,4.75 14.5,6 16.75,6 16.75,9 18,9 18,12.25 14.5,12.25 14.5,12.75 13.25,12.75 13.25,20.75 5.75,20.75 v5.75,21.5
PWM_L_1  (via drill 0.4)
  Top 0.3: IC7.42 10,29.25 10.75,29.25 10.75,26 v10.25,26
  Route15 0.3: v11.25,18.5 25,18.5 25,16 25.25,15.75 27.5,15.75 27.5,13.5 29.5,13.5 29.5,5.75 28.75,5.75 v28.75,5
  Bottom 0.3: v28.75,5 28.75,4 R_LIM_L_1_1.2 | v10.25,26 11.25,26 v11.25,18.5
PWM_L_2  (via drill 0.4)
  Top 0.3: IC7.43 9.5,28.75 10.25,28.75 10.25,27 v10,27
  Route15 0.3: v10,27 11,27 11,23.75 14.5,23.75 14.5,22.25 22.75,22.25 22.75,22.75 24.5,22.75 24.5,23 29,23 29,15 34.25,15 v34.25,15.75
  Bottom 0.3: R_LIM_L_1_2.2 38.75,15.75 v34.25,15.75
PWM_L_3  (via drill 0.4)
  Top 0.3: IC7.45 8.5,29.25 9,29.25 9,28.25 9.5,28.25 v9.5,28
  Route15 0.3: v9.5,28 5.25,28 5.25,23.5 4.25,23.5 4.25,17.25 10.5,17.25 v10.5,16.5
  Bottom 0.3: v10.5,16.5 10.5,15.5 10.25,15.5 R_LIM_L_1_3.2
QEPA1  (via drill 0.4)
  Top 0.3: IC7.16 8.5,18.75 v8,18.75 | ENC1.3 26.75,19.02 v26.75,19.75
  Route15 0.3: v8,18.75 8,20.25 10.5,20.25 10.5,19.25 26.75,19.25 v26.75,19.75
QEPB1  (via drill 0.4)
  Top 0.3: IC7.14 7.5,20 v6.75,20 | ENC1.4 25.75,19.68 v25.75,20
  Route15 0.3: v6.75,20 6.75,20.75 11,20.75 11,19.75 25.75,19.75 v25.75,20
REGOUT_1
  Bottom 0.3: 19.72,16 C_IMU_FILT_1.1 19.75,16 U$10.P$10
SW1
  Top 0.3: SW_REG1.12 37.48,31.23 SW_REG1.13 36.75,33 C_BOOST1.2 35.25,33 SW_REG1.16 34.52,31.23 SW_REG1.1
  Top 0.5: L_REG1.1 36.15,35.35 C_BOOST1.2
THERM  (via drill 0.4)
  Top 0.3: IC7.26 13,23.75 13,24.75 12.25,24.75 v12.25,25
  Route2 0.3: v12.25,25 17.25,25 17.25,15.75 21,15.75 21,6.75 22,6.75 v22,6.5
  Bottom 0.3: C_THERM_1.1 21,5.5 | R_THERM_1.2 21,5.5 | 21,5.5 T_THERM_1.2 | 21,6.65 T_THERM_1.2 | T_THERM_1.2 v22,6.5
V+  (via drill 0.4, 0.6, 1.6)
  Top 0.3: R_INV_PU3.2 11.75,1.75 11.75,0.75 15.75,0.75 15.75,1.75 | ZXGD3004E6_H_1.1 30.6,14.7 | CIN2_1.1 33,29.75 | SW_REG1.3 SW_REG1.2 34.52,29.75 | SW_REG1.11 38.5,30 v38.5,31.25 | CS_2.P3 16.1,5.35 16.1,4.5 15.75,4.5 15.75,3.25 | 1.25,11 0.9,11 R_INV_PU2.2 0.9,13.25 1.75,13.25 1.75,15.75 3.5,15.75 3.5,15.2 ZXGD3004E6_H_2.1 8.25,15.2 v8.25,15.75 | ZXGD3004E6_H_1.1 30.35,16.25 R_INV_PU1.2 | ZXGD3004E6_H_1.1 28,14.7 28,13.75 25.25,13.75 25.25,13.5 | 15.75,1.75 15.75,3.25 | v15.25,3.25 15.75,3.25 | v35.5,1.75 35.5,4.1 C_CS_DC_1.1 35,4.4 CS_1.P3 | ZXGD3004E6_H_3.1 4.5,2.8 4.5,1 v1,1 | 31,29.75 CIN1_1.1 31,30.1 28,30.1 | C2.1 26.25,30.1 28,30.1 | C_CS_DC_2.1 15.75,1.75 | D_OV_1.C 28,28.5 28,30.1
  Top 0.406: U$13.3 33,32.35
  Top 0.5: CIN1_1.1 CIN2_1.1 33,32.35 v33,34.25 | 33,29.75 34.52,29.75
  Bottom 0.3: R_CS_4.1 31,20.75 R_S1_1.2 R_V_SENSE_1_1.2 27.5,22.9 D_UV_1.C | v38.5,31.25 38.5,34.25 v33,34.25 | v1,1 1,3.6 C_CS_DC_3.1 2.5,4.4 CS_3.P3 | ZXGD3004E6_L_1.1 35.5,2.8 v35.5,1.75 | v8.25,15.75 5.65,15.75 ZXGD3004E6_L_3.1 | ZXGD3004E6_L_2.1 33.5,14.7 33.5,17 | 33.5,17 33.5,17.25 32.75,17.25 v31.75,18.5 | C1.+ 34.67,17 33.5,17
  other vias: 38,7.25 24.5,14.25 2,10.25
  pour Top (no thermals): 5.5,12 0,12 0,5.5 5.5,5.5
  pour Top (no thermals): 40,12 34.5,12 34.5,5.5 40,5.5
  pour Top (no thermals): 18,16 18,12.5 26.25,12.5 26.25,16
  pour Bottom (no thermals): 30,22 33.25,22 33.25,17.25 30,17.25
  pour Route15 (rank 2): 0,0 40,0 40,40 29,40 29,21.5 0,21.5
V_BATT
  Bottom 0.3: R_CS_4.2 32.75,20.75 R_S2_1.2 | CS_4.P3 32.75,30.35 32.75,29 33.75,29 C_CS_DC_4.1 33.75,23.6 35,23.6
  Bottom 1.8: U$8.P$1 35,23.6 35,21 R_CS_4.2
V_REF_CS  (via drill 0.4)
  Top 0.3: CS_1.P1 33,3.1 v33,2.75 | v14.5,7.25 14.5,6.5 16,6.5 16,6.65 CS_2.P1
  Route2 0.3: v29.25,29.25 30,29.25 30,2.75 v33,2.75
  Route15 0.3: v7,2.25 7,5.25 12.5,5.25 | 12.5,5.25 14.25,5.25 14.25,7.25 v14.5,7.25 | 12.5,5.25 12.5,2.5 16,2.5 16,4.25 24.25,4.25 24.25,2.25 29.75,2.25 29.75,2.75 v33,2.75
  Bottom 0.3: R_CS_REF2_4.2 R_CS_REF1_4.1 30.85,32.5 CS_4.P1 29.25,30.35 v29.25,29.25 | CS_3.P1 6.4,2.25 v7,2.25
ZB_AVDD1
  Bottom 0.3: RADIO1.29 9.25,34.25 9.25,33.75 10.25,33.75 CB1.1
ZB_BAL1_1
  Bottom 0.3: C_RF_CU1_1.2 3.65,29.15 BALUN1.3
ZB_BAL2_1
  Bottom 0.3: C_RF_CU2_1.2 8.35,29.15 BALUN1.4
ZB_DVDD1
  Bottom 0.3: RADIO1.14 RADIO1.13 1.75,34.75 CB3.1
ZB_IRQ_1  (via drill 0.4)
  Top 0.3: IC7.4 7,27.25 7,26.5 v7.25,26.5
  Route2 0.3: v4,38.5 4,31.75 7,31.75 7,26.5 v7.25,26.5
  Bottom 0.3: RADIO1.24 9,36.88 9,39.25 4.25,39.25 4.25,38.5 v4,38.5
ZB_MISO_1  (via drill 0.4)
  Top 0.3: IC7.40 11,32.75 12.75,32.75 v12.75,32
  Route2 0.3: v12.75,32 12.75,32.75 6,32.75 v6,38.5
  Bottom 0.3: RADIO1.20 5.75,38.5 v6,38.5
ZB_MOSI_1  (via drill 0.4)
  Top 0.3: IC7.41 10.5,33.5 v11.5,33.5
  Route2 0.3: v11.5,33.5 7,33.5 v7,38.5
  Bottom 0.3: RADIO1.22 6.75,38.5 v7,38.5
ZB_RFN1
  Bottom 0.3: RADIO1.4 6.25,30.5 C_RF_CU2_1.1
ZB_RFP1
  Bottom 0.3: RADIO1.5 5.75,30.5 C_RF_CU1_1.1
ZB_SCLK_1  (via drill 0.4)
  Top 0.3: IC7.39 11.5,31.75 11.75,31.75 v11.75,32
  Route2 0.3: v11.75,32 11.75,32.25 5,32.25 v5,38.5
  Bottom 0.3: RADIO1.19 5.25,38.5 v5,38.5
ZB_SEL_1  (via drill 0.4)
  Top 0.3: IC7.3 7.5,27.75 7.5,27.25 8.25,27.25 v8.25,27
  Route2 0.3: v8,38.5 8,39.25 3.25,39.25 3.25,37.75 3.5,37.75 3.5,31.25 6.5,31.25 6.5,25.25 9.25,25.25 9.25,27 v8.25,27
  Bottom 0.3: RADIO1.23 7.25,37.75 8,37.75 v8,38.5
(copper drawn outside any net)
  shapes: Bottom circle x2, Top circle x2

### Text on the board
tPlace: 1 | 2 | 3 | 4 | GND
bPlace: Y | 2013 | X | Z | Matthew Piccoli
tValues: Red | White | Green | Amber | AS5145B
bValues: SM05B-GHS-TB | MPU-6050 | INA21X